# EAGLE schematic PX4uNode_V0_1_3 (EAGLE 6.5.0)

## Sheet 1 of 11
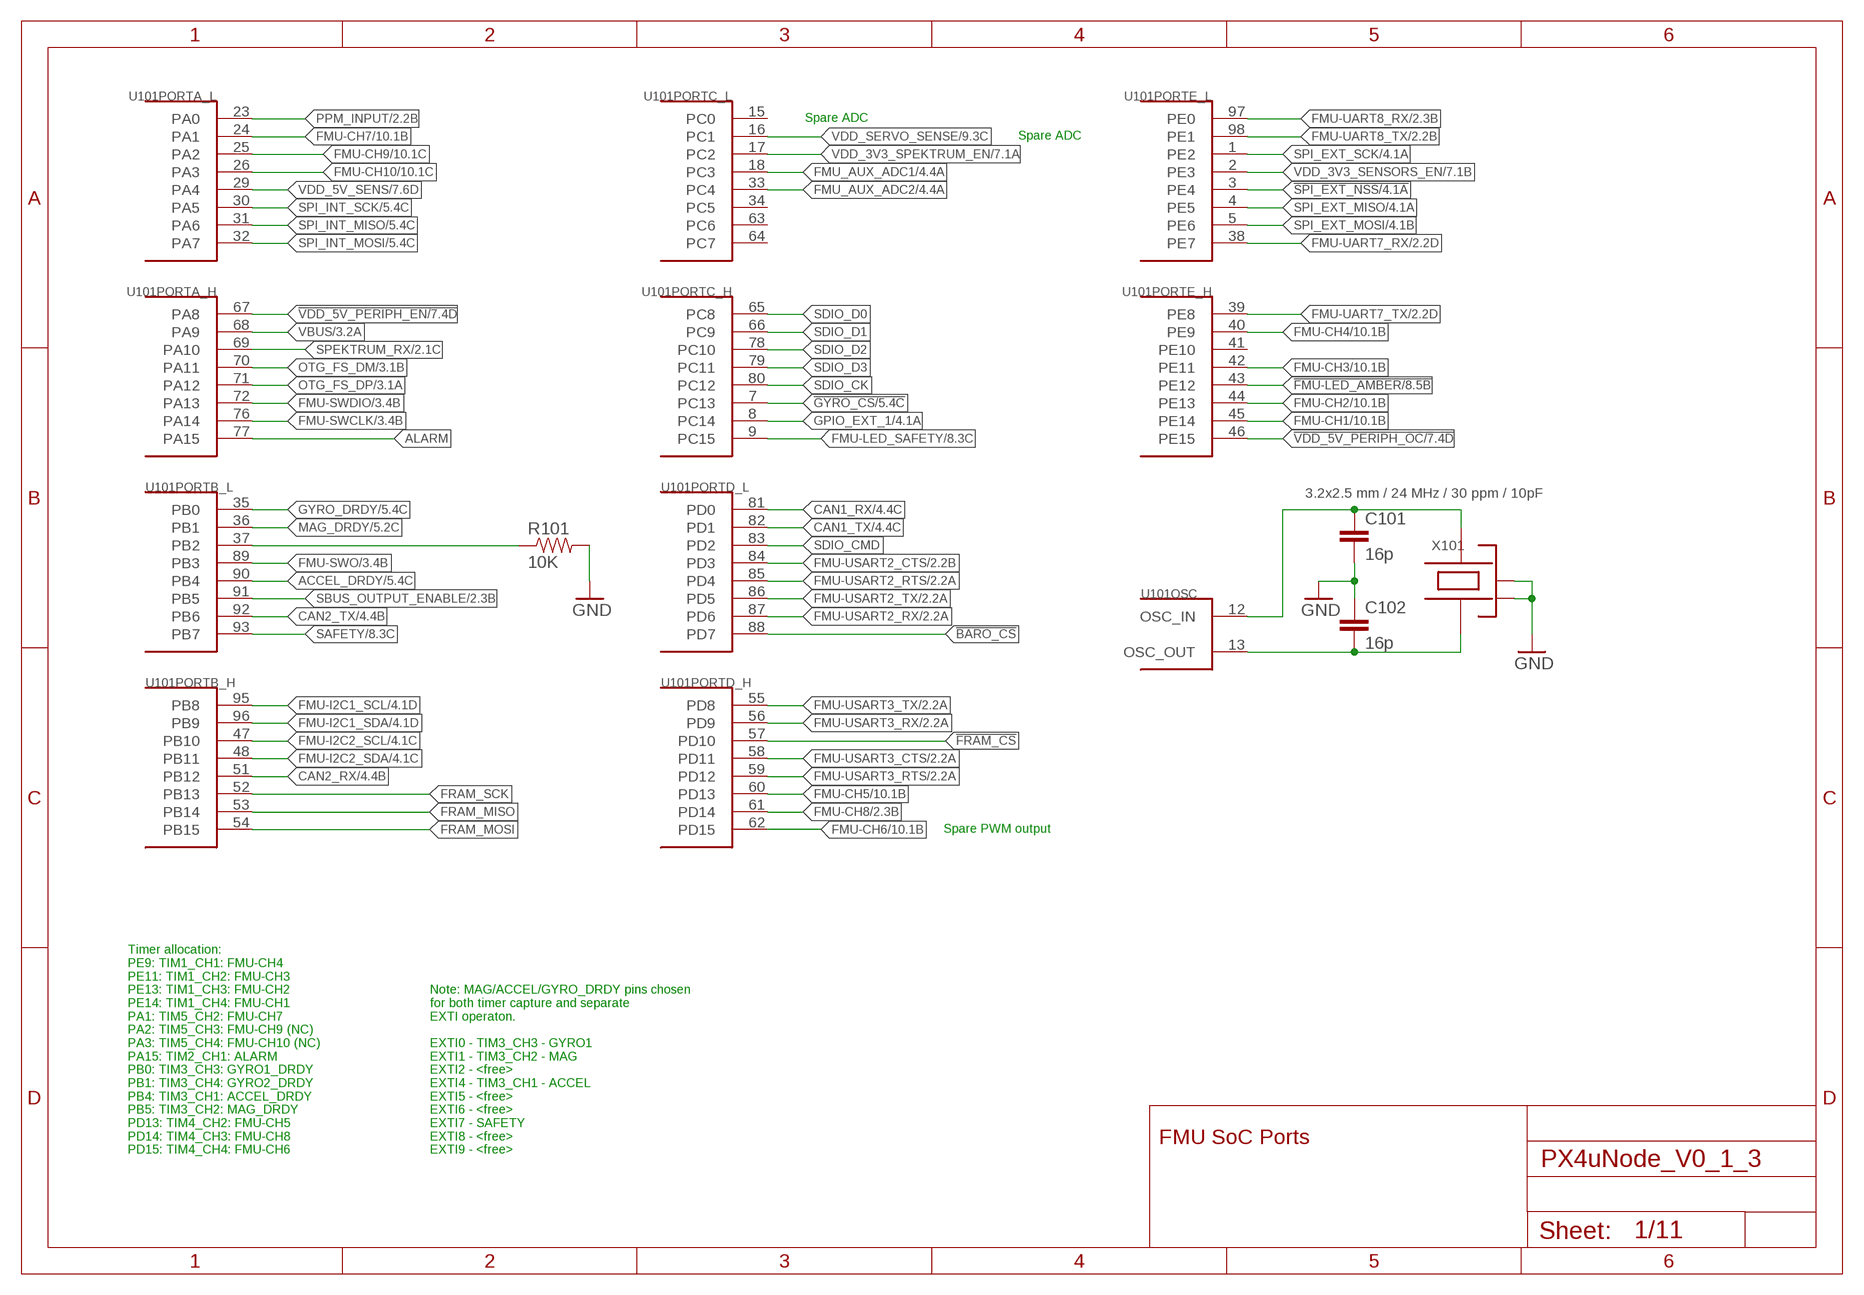
[diagram p0: schematic, sheet 1]

### Parts
C101  16p  CAP0402  [0402-CAP]
C102  16p  CAP0402  [0402-CAP]
R101  10K  RESISTOR0402-RES  [0402-RES]
U101  STM32F4X7VX  [TQFP100]
X101  3.2x2.5 mm / 24 MHz / 30 ppm / 10pF  OSCILLATOR-3.2X2.5  [OSCILLATOR-3.2X2.5]

### Nets
!BARO_CS: U101.88(PORTD_L:PD7)
!FMU-LED_AMBER: U101.43(PORTE_H:PE12) ; also sheet 8
!FRAM_CS: U101.57(PORTD_H:PD10)
!GYRO_CS: U101.7(PORTC_H:PC13) ; also sheet 5
!SPI_EXT_NSS: U101.3(PORTE_L:PE4) ; also sheet 4
!VDD_5V_PERIPH_EN: U101.67(PORTA_H:PA8) ; also sheet 7
!VDD_5V_PERIPH_OC: U101.46(PORTE_H:PE15) ; also sheet 7
ACCEL_DRDY: U101.90(PORTB_L:PB4) ; also sheet 5
ALARM: U101.77(PORTA_H:PA15)
CAN1_RX: U101.81(PORTD_L:PD0) ; also sheet 4
CAN1_TX: U101.82(PORTD_L:PD1) ; also sheet 4
CAN2_RX: U101.51(PORTB_H:PB12) ; also sheet 4
CAN2_TX: U101.92(PORTB_L:PB6) ; also sheet 4
CLK1: C101.P$1 U101.12(OSC:OSC_IN) X101.3
CLK2: C102.P$2 U101.13(OSC:OSC_OUT) X101.1
FMU-CH1: U101.45(PORTE_H:PE14) ; also sheet 10
FMU-CH2: U101.44(PORTE_H:PE13) ; also sheet 10
FMU-CH3: U101.42(PORTE_H:PE11) ; also sheet 10
FMU-CH4: U101.40(PORTE_H:PE9) ; also sheet 10
FMU-CH5: U101.60(PORTD_H:PD13) ; also sheet 10
FMU-CH6: U101.62(PORTD_H:PD15) ; also sheet 10
FMU-CH7: U101.24(PORTA_L:PA1) ; also sheet 10
FMU-CH8: U101.61(PORTD_H:PD14) ; also sheet 2,10
FMU-CH9: U101.25(PORTA_L:PA2) ; also sheet 10
FMU-CH10: U101.26(PORTA_L:PA3) ; also sheet 10
FMU-I2C1_SCL: U101.95(PORTB_H:PB8) ; also sheet 4
FMU-I2C1_SDA: U101.96(PORTB_H:PB9) ; also sheet 4
FMU-I2C2_SCL: U101.47(PORTB_H:PB10) ; also sheet 4
FMU-I2C2_SDA: U101.48(PORTB_H:PB11) ; also sheet 4
FMU-LED_SAFETY: U101.9(PORTC_H:PC15) ; also sheet 8
FMU-SWCLK: U101.76(PORTA_H:PA14) ; also sheet 3
FMU-SWDIO: U101.72(PORTA_H:PA13) ; also sheet 3
FMU-SWO: U101.89(PORTB_L:PB3) ; also sheet 3
FMU-UART7_RX: U101.38(PORTE_L:PE7) ; also sheet 2
FMU-UART7_TX: U101.39(PORTE_H:PE8) ; also sheet 2
FMU-UART8_RX: U101.97(PORTE_L:PE0) ; also sheet 2
FMU-UART8_TX: U101.98(PORTE_L:PE1) ; also sheet 2
FMU-USART2_CTS: U101.84(PORTD_L:PD3) ; also sheet 2
FMU-USART2_RTS: U101.85(PORTD_L:PD4) ; also sheet 2
FMU-USART2_RX: U101.87(PORTD_L:PD6) ; also sheet 2
FMU-USART2_TX: U101.86(PORTD_L:PD5) ; also sheet 2
FMU-USART3_CTS: U101.58(PORTD_H:PD11) ; also sheet 2
FMU-USART3_RTS: U101.59(PORTD_H:PD12) ; also sheet 2
FMU-USART3_RX: U101.56(PORTD_H:PD9) ; also sheet 2
FMU-USART3_TX: U101.55(PORTD_H:PD8) ; also sheet 2
FMU_AUX_ADC1: U101.18(PORTC_L:PC3) ; also sheet 4
FMU_AUX_ADC2: U101.33(PORTC_L:PC4) ; also sheet 4
FRAM_MISO: U101.53(PORTB_H:PB14)
FRAM_MOSI: U101.54(PORTB_H:PB15)
FRAM_SCK: U101.52(PORTB_H:PB13)
GND [power]: C101.P$2 C102.P$1 R101.P$2 X101.2(NC_2) X101.4(NC_4) ; also sheet 2,3,4,5,6,7,8,9,10
GPIO_EXT_1: U101.8(PORTC_H:PC14) ; also sheet 4
GYRO_DRDY: U101.35(PORTB_L:PB0) ; also sheet 5
MAG_DRDY: U101.36(PORTB_L:PB1) ; also sheet 5
OTG_FS_DM: U101.70(PORTA_H:PA11) ; also sheet 3
OTG_FS_DP: U101.71(PORTA_H:PA12) ; also sheet 3
PB2-BOOT1: R101.P$1 U101.37(PORTB_L:PB2)
PPM_INPUT: U101.23(PORTA_L:PA0) ; also sheet 2
SAFETY: U101.93(PORTB_L:PB7) ; also sheet 8
SBUS_OUTPUT_ENABLE: U101.91(PORTB_L:PB5) ; also sheet 2
SDIO_CK: U101.80(PORTC_H:PC12) ; also sheet 3
SDIO_CMD: U101.83(PORTD_L:PD2) ; also sheet 3
SDIO_D0: U101.65(PORTC_H:PC8) ; also sheet 3
SDIO_D1: U101.66(PORTC_H:PC9) ; also sheet 3
SDIO_D2: U101.78(PORTC_H:PC10) ; also sheet 3
SDIO_D3: U101.79(PORTC_H:PC11) ; also sheet 3
SPEKTRUM_RX: U101.69(PORTA_H:PA10) ; also sheet 2
SPI_EXT_MISO: U101.4(PORTE_L:PE5) ; also sheet 4
SPI_EXT_MOSI: U101.5(PORTE_L:PE6) ; also sheet 4
SPI_EXT_SCK: U101.1(PORTE_L:PE2) ; also sheet 4
SPI_INT_MISO: U101.31(PORTA_L:PA6) ; also sheet 5
SPI_INT_MOSI: U101.32(PORTA_L:PA7) ; also sheet 5
SPI_INT_SCK: U101.30(PORTA_L:PA5) ; also sheet 5
VBUS [power]: U101.68(PORTA_H:PA9) ; also sheet 3,9
VDD_3V3_SENSORS_EN: U101.2(PORTE_L:PE3) ; also sheet 7
VDD_3V3_SPEKTRUM_EN: U101.17(PORTC_L:PC2) ; also sheet 7
VDD_5V_SENS: U101.29(PORTA_L:PA4) ; also sheet 7
VDD_SERVO_SENSE: U101.16(PORTC_L:PC1) ; also sheet 9
Unconnected: U101.15(PORTC_L:PC0) U101.34(PORTC_L:PC5) U101.41(PORTE_H:PE10) U101.63(PORTC_L:PC6) U101.64(PORTC_L:PC7)

### Notes on the sheet
- Spare ADC
- Spare ADC
- Spare PWM output
- Timer allocation:
  PE9: TIM1_CH1: FMU-CH4
  PE11: TIM1_CH2: FMU-CH3
  PE13: TIM1_CH3: FMU-CH2
  PE14: TIM1_CH4: FMU-CH1
  PA1: TIM5_CH2: FMU-CH7
  PA2: TIM5_CH3: FMU-CH9 (NC)
  PA3: TIM5_CH4: FMU-CH10 (NC)
  PA15: TIM2_CH1: ALARM
  PB0: TIM3_CH3: GYRO1_DRDY
  PB1: TIM3_CH4: GYRO2_DRDY
  PB4: TIM3_CH1: ACCEL_DRDY
  PB5: TIM3_CH2: MAG_DRDY
  PD13: TIM4_CH2: FMU-CH5
  PD14: TIM4_CH3: FMU-CH8
  PD15: TIM4_CH4: FMU-CH6
- Note: MAG/ACCEL/GYRO_DRDY pins chosen
  for both timer capture and separate
  EXTI operaton.
  
  EXTI0 - TIM3_CH3 - GYRO1
  EXTI1 - TIM3_CH2 - MAG
  EXTI2 - <free>
  EXTI4 - TIM3_CH1 - ACCEL
  EXTI5 - <free>
  EXTI6 - <free>
  EXTI7 - SAFETY
  EXTI8 - <free>
  EXTI9 - <free>
- FMU SoC Ports

## Sheet 2 of 11
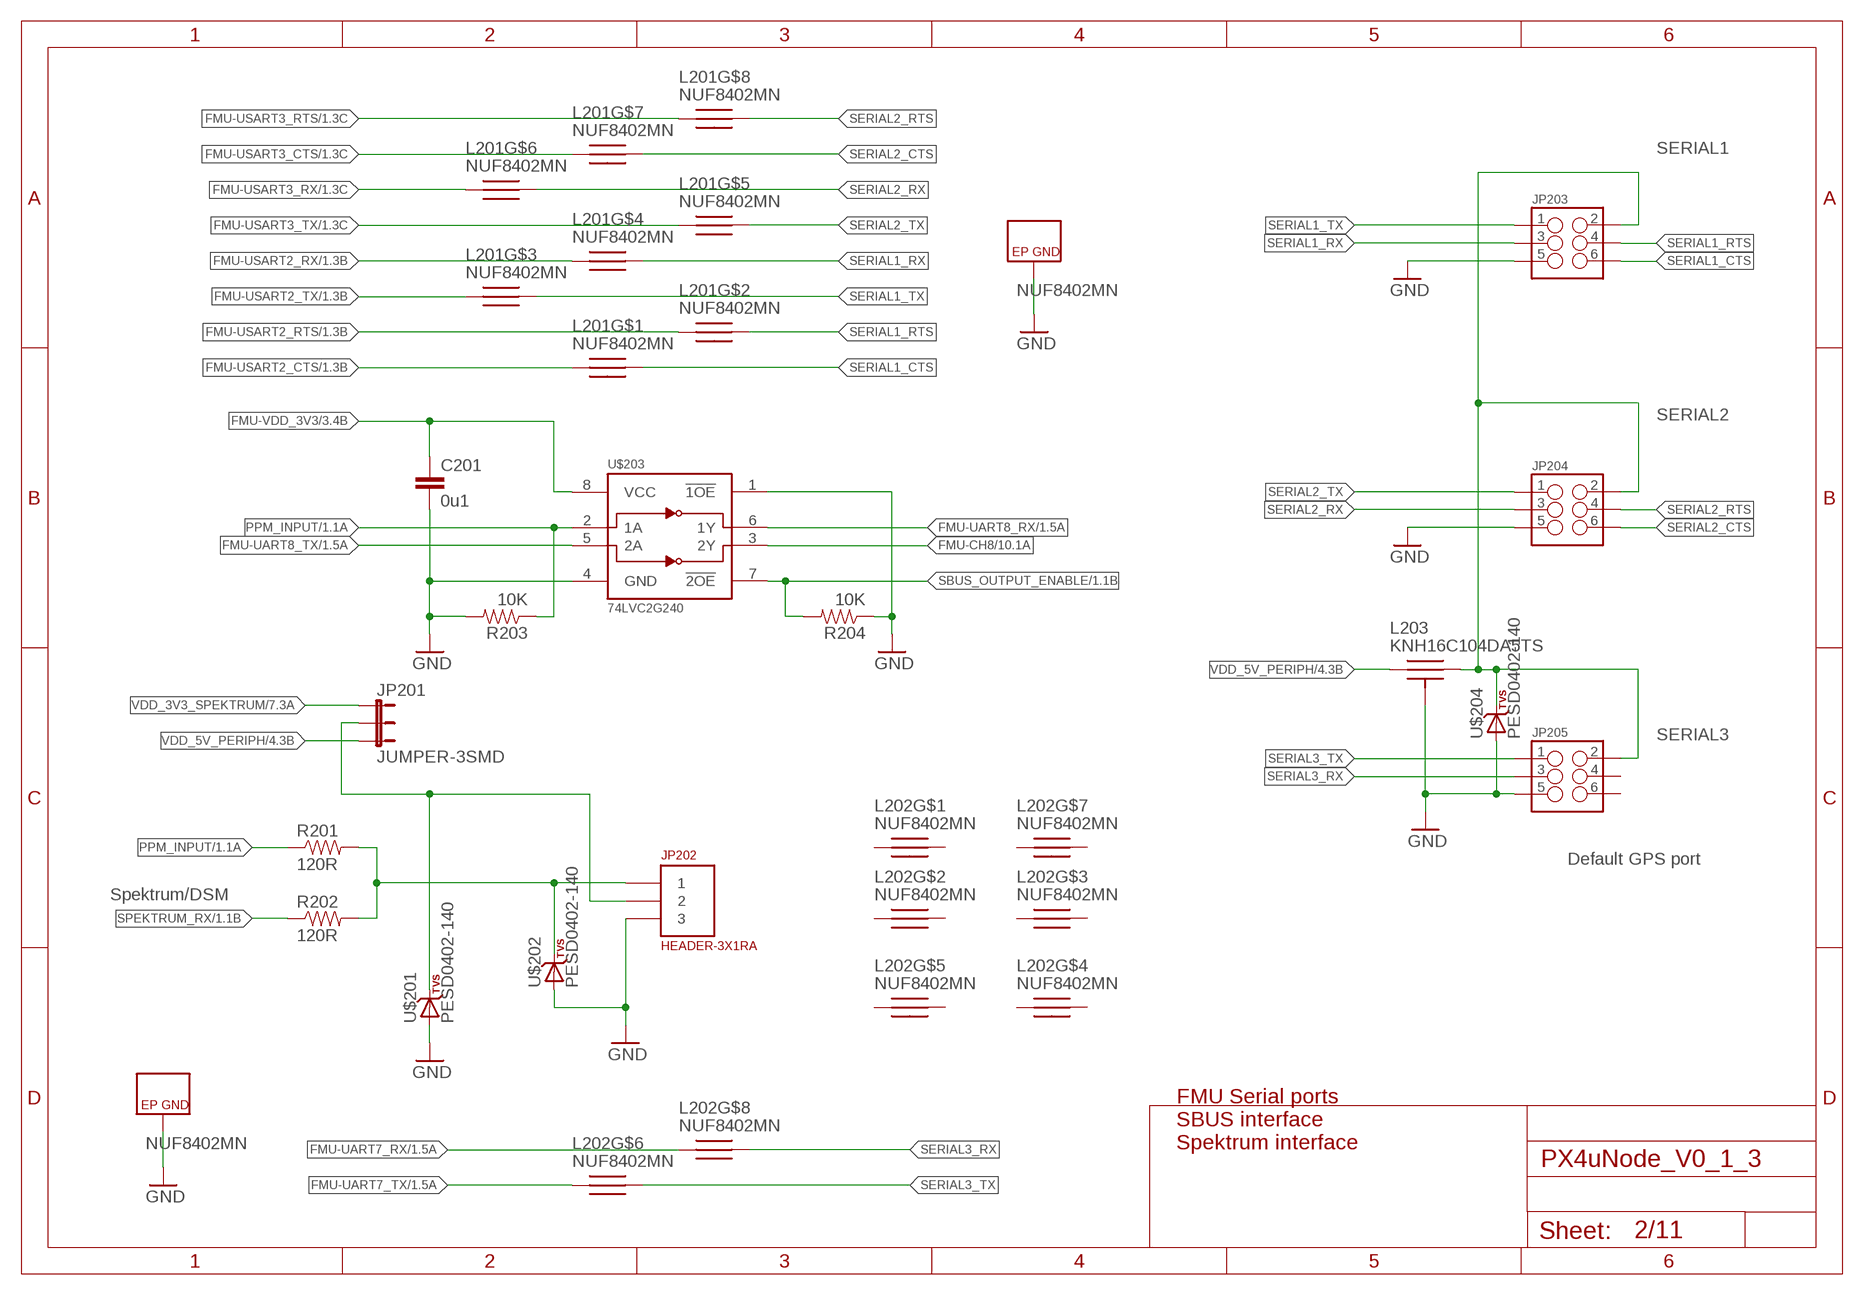
[diagram p1: schematic, sheet 2]

### Parts
C201  0u1  CAP0402  [0402-CAP]
JP201  JUMPER-3SMD  [SJ_3]
JP202  HEADER-3X1RA  [3X1RA]
JP203  M03X22X3_SILK_SM  [2X3]
JP204  M03X22X3_SILK_SM  [2X3]
JP205  M03X22X3_SILK_SM  [2X3]
L201  NUF8402MN  [DFN16-THIN]
L202  NUF8402MN  [DFN16-THIN]
L203  KNH16C104DA5TS  [KYOCERA-KNH16-DA]
R201  120R  RESISTOR0402-RES  [0402-RES]
R202  120R  RESISTOR0402-RES  [0402-RES]
R203  10K  RESISTOR0402-RES  [0402-RES]
R204  10K  RESISTOR0402-RES  [0402-RES]
U$201  PESD0402-140  DIODE-TVS  [0402-TVS]
U$202  PESD0402-140  DIODE-TVS  [0402-TVS]
U$203  74LVC2G240  [VSSOP8]
U$204  PESD0402-140  DIODE-TVS  [0402-TVS]

### Nets
5V_S3_FILTERED [power]: JP203.2 JP204.2 JP205.2 L203.P$2 U$204.C
FMU-CH8: U$203.3(2Y) ; also sheet 1,10
FMU-UART7_RX: L202.P$8 ; also sheet 1
FMU-UART7_TX: L202.P$6 ; also sheet 1
FMU-UART8_RX: U$203.6(1Y) ; also sheet 1
FMU-UART8_TX: U$203.5(2A) ; also sheet 1
FMU-USART2_CTS: L201.P$1 ; also sheet 1
FMU-USART2_RTS: L201.P$2 ; also sheet 1
FMU-USART2_RX: L201.P$4 ; also sheet 1
FMU-USART2_TX: L201.P$3 ; also sheet 1
FMU-USART3_CTS: L201.P$7 ; also sheet 1
FMU-USART3_RTS: L201.P$8 ; also sheet 1
FMU-USART3_RX: L201.P$6 ; also sheet 1
FMU-USART3_TX: L201.P$5 ; also sheet 1
FMU-VDD_3V3 [power]: C201.P$1 U$203.8(VCC) ; also sheet 3,4,7,8
GND [power]: C201.P$2 JP202.3 JP203.5 JP204.5 JP205.5 L201.P$EP(GND) L202.P$EP(GND) L203.P$3 L203.P$4 L203.P$5 R203.P$2 R204.P$1 U$201.A U$202.A U$203.1(!1OE) U$203.4(GND) U$204.A ; also sheet 1,3,4,5,6,7,8,9,10
N$2: JP202.1 R201.P$2 R202.P$2 U$202.C
N$18: JP201.2 JP202.2 U$201.C
PPM_INPUT: R201.P$1 R203.P$1 U$203.2(1A) ; also sheet 1
SBUS_OUTPUT_ENABLE: R204.P$2 U$203.7(!2OE) ; also sheet 1
SERIAL1_CTS: JP203.6 L201.P$16
SERIAL1_RTS: JP203.4 L201.P$15
SERIAL1_RX: JP203.3 L201.P$13
SERIAL1_TX: JP203.1 L201.P$14
SERIAL2_CTS: JP204.6 L201.P$10
SERIAL2_RTS: JP204.4 L201.P$9
SERIAL2_RX: JP204.3 L201.P$11
SERIAL2_TX: JP204.1 L201.P$12
SERIAL3_RX: JP205.3 L202.P$9
SERIAL3_TX: JP205.1 L202.P$11
SPEKTRUM_RX: R202.P$1 ; also sheet 1
VDD_3V3_SPEKTRUM [power]: JP201.1 ; also sheet 7
VDD_5V_PERIPH [power]: JP201.3 L203.P$1 ; also sheet 4,7
Unconnected: JP205.4 JP205.6 L202.P$1 L202.P$2 L202.P$3 L202.P$4 L202.P$5 L202.P$7 L202.P$10 L202.P$12 L202.P$13 L202.P$14 L202.P$15 L202.P$16

### Notes on the sheet
- SERIAL1
- SERIAL2
- SERIAL3
- Default GPS port
- Spektrum/DSM
- FMU Serial ports
  SBUS interface
  Spektrum interface

## Sheet 3 of 11
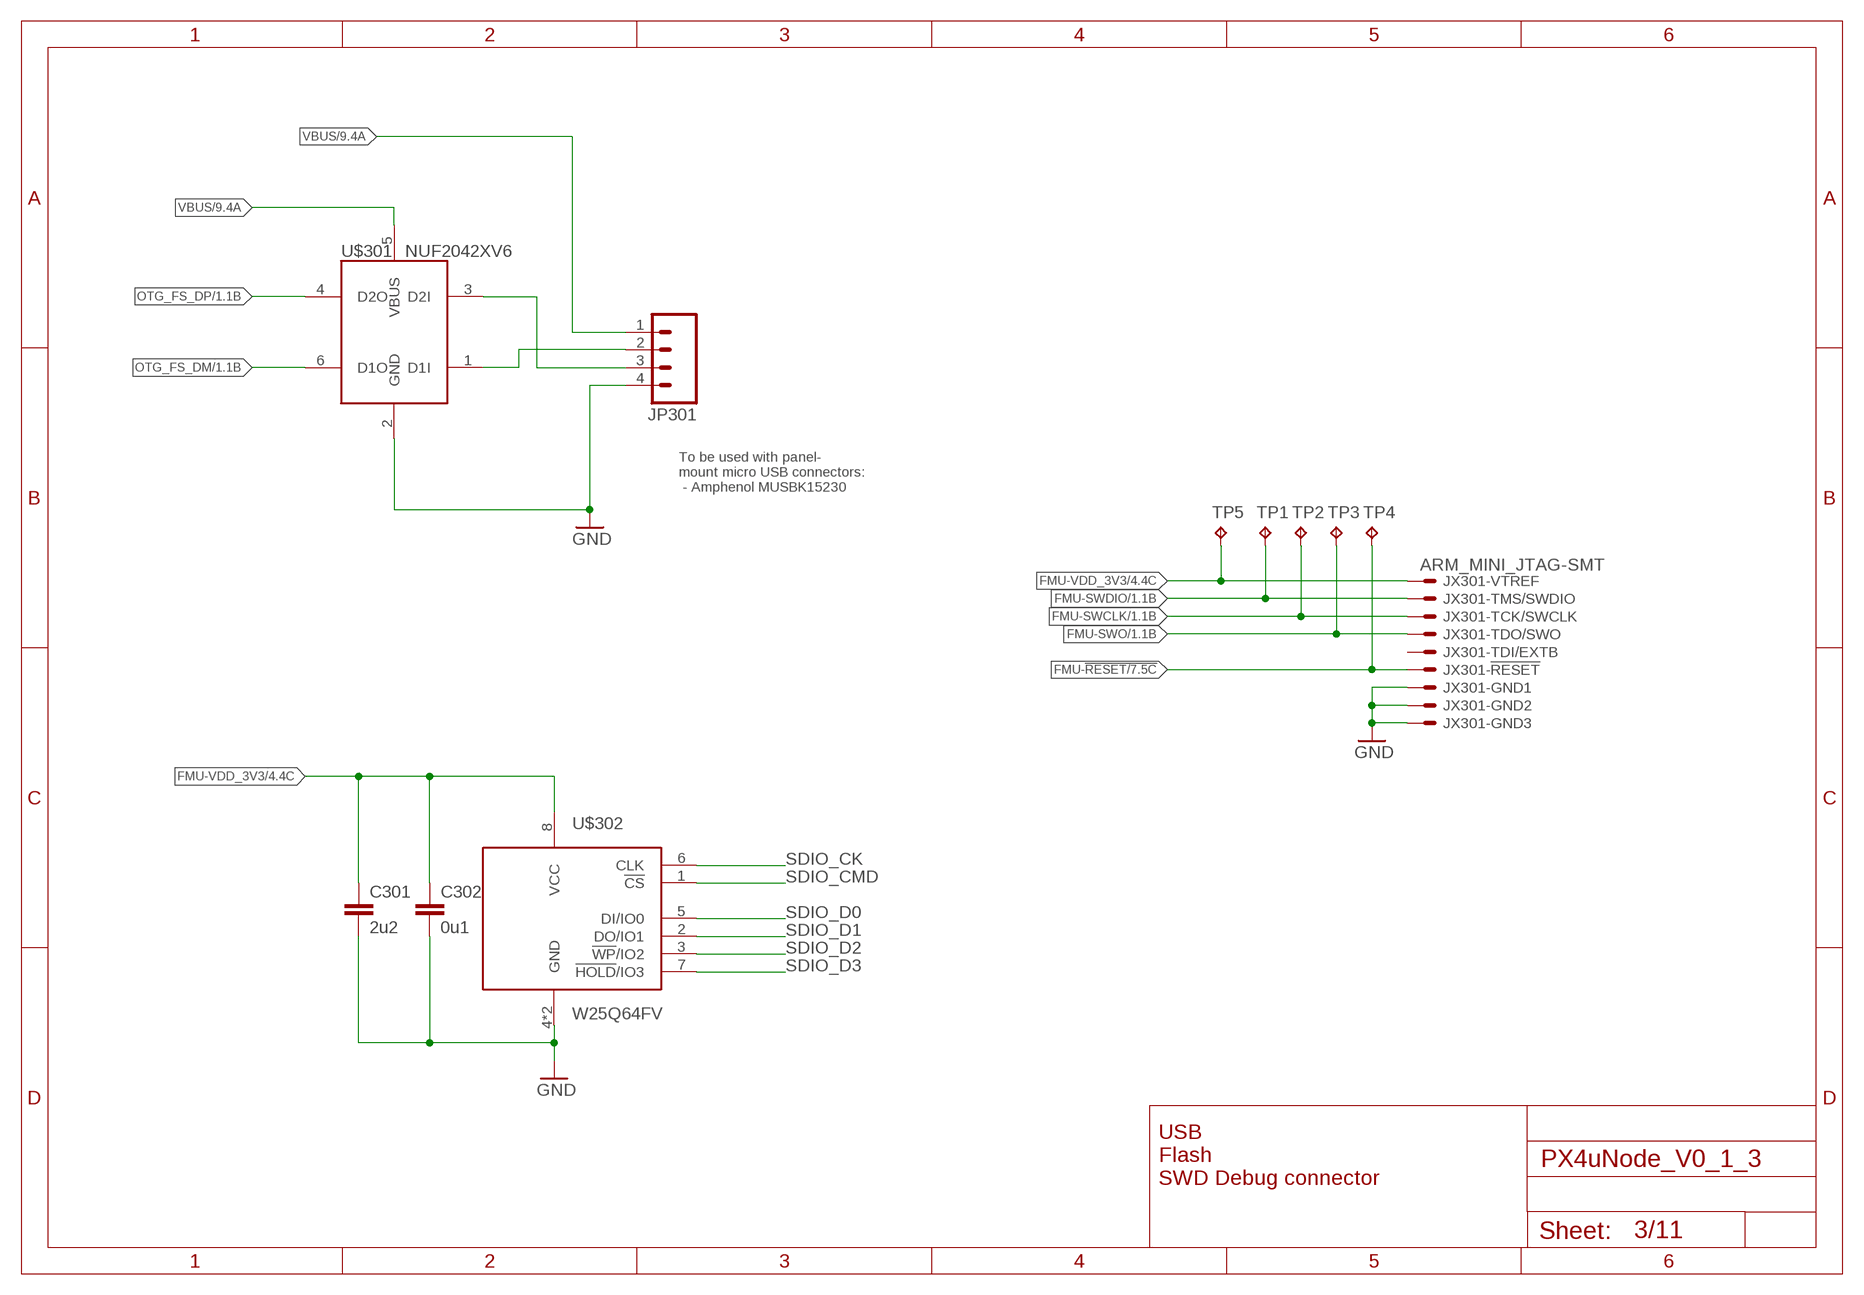
[diagram p2: schematic, sheet 3]

### Parts
C301  2u2  CAP0603  [0603-CAP]
C302  0u1  CAP0402  [0402-CAP]
JP301  M04PTH  [1X04]
JX301  ARM_MINI_JTAG-SMT  [FTSH-105-01-XXX-DV-K]
TP1  TPTP20R  [TP20R]
TP2  TPTP20R  [TP20R]
TP3  TPTP20R  [TP20R]
TP4  TPTP20R  [TP20R]
TP5  TPTP20R  [TP20R]
U$301  NUF2042XV6  [SOT563-6]
U$302  W25Q64FV  [WSON-8-5X6]

### Nets
FMU-!RESET: JX301.10 TP4.TP ; also sheet 7
FMU-SWCLK: JX301.4 TP2.TP ; also sheet 1
FMU-SWDIO: JX301.2 TP1.TP ; also sheet 1
FMU-SWO: JX301.6 TP3.TP ; also sheet 1
FMU-VDD_3V3 [power]: C301.P$1 C302.P$1 JX301.1 TP5.TP U$302.8(VCC) ; also sheet 2,4,7,8
GND [power]: C301.P$2 C302.P$2 JP301.4 JX301.3 JX301.5 JX301.9 U$301.2(GND) U$302.4(GND) U$302.PAD(GND) ; also sheet 1,2,4,5,6,7,8,9,10
OTG_FS_DM: U$301.6(D1O) ; also sheet 1
OTG_FS_DP: U$301.4(D2O) ; also sheet 1
SDIO_CK: U$302.6(CLK) ; also sheet 1
SDIO_CMD: U$302.1(!CS) ; also sheet 1
SDIO_D0: U$302.5(DI/IO0) ; also sheet 1
SDIO_D1: U$302.2(DO/IO1) ; also sheet 1
SDIO_D2: U$302.3(!WP!/IO2) ; also sheet 1
SDIO_D3: U$302.7(!HOLD!/IO3) ; also sheet 1
UDB_DP: JP301.3 U$301.3(D2I)
USB_DM: JP301.2 U$301.1(D1I)
VBUS [power]: JP301.1 U$301.5(VBUS) ; also sheet 1,9
Unconnected: JX301.8

### Notes on the sheet
- To be used with panel-
  mount micro USB connectors:
   - Amphenol MUSBK15230
- USB
  Flash
  SWD Debug connector

## Sheet 4 of 11
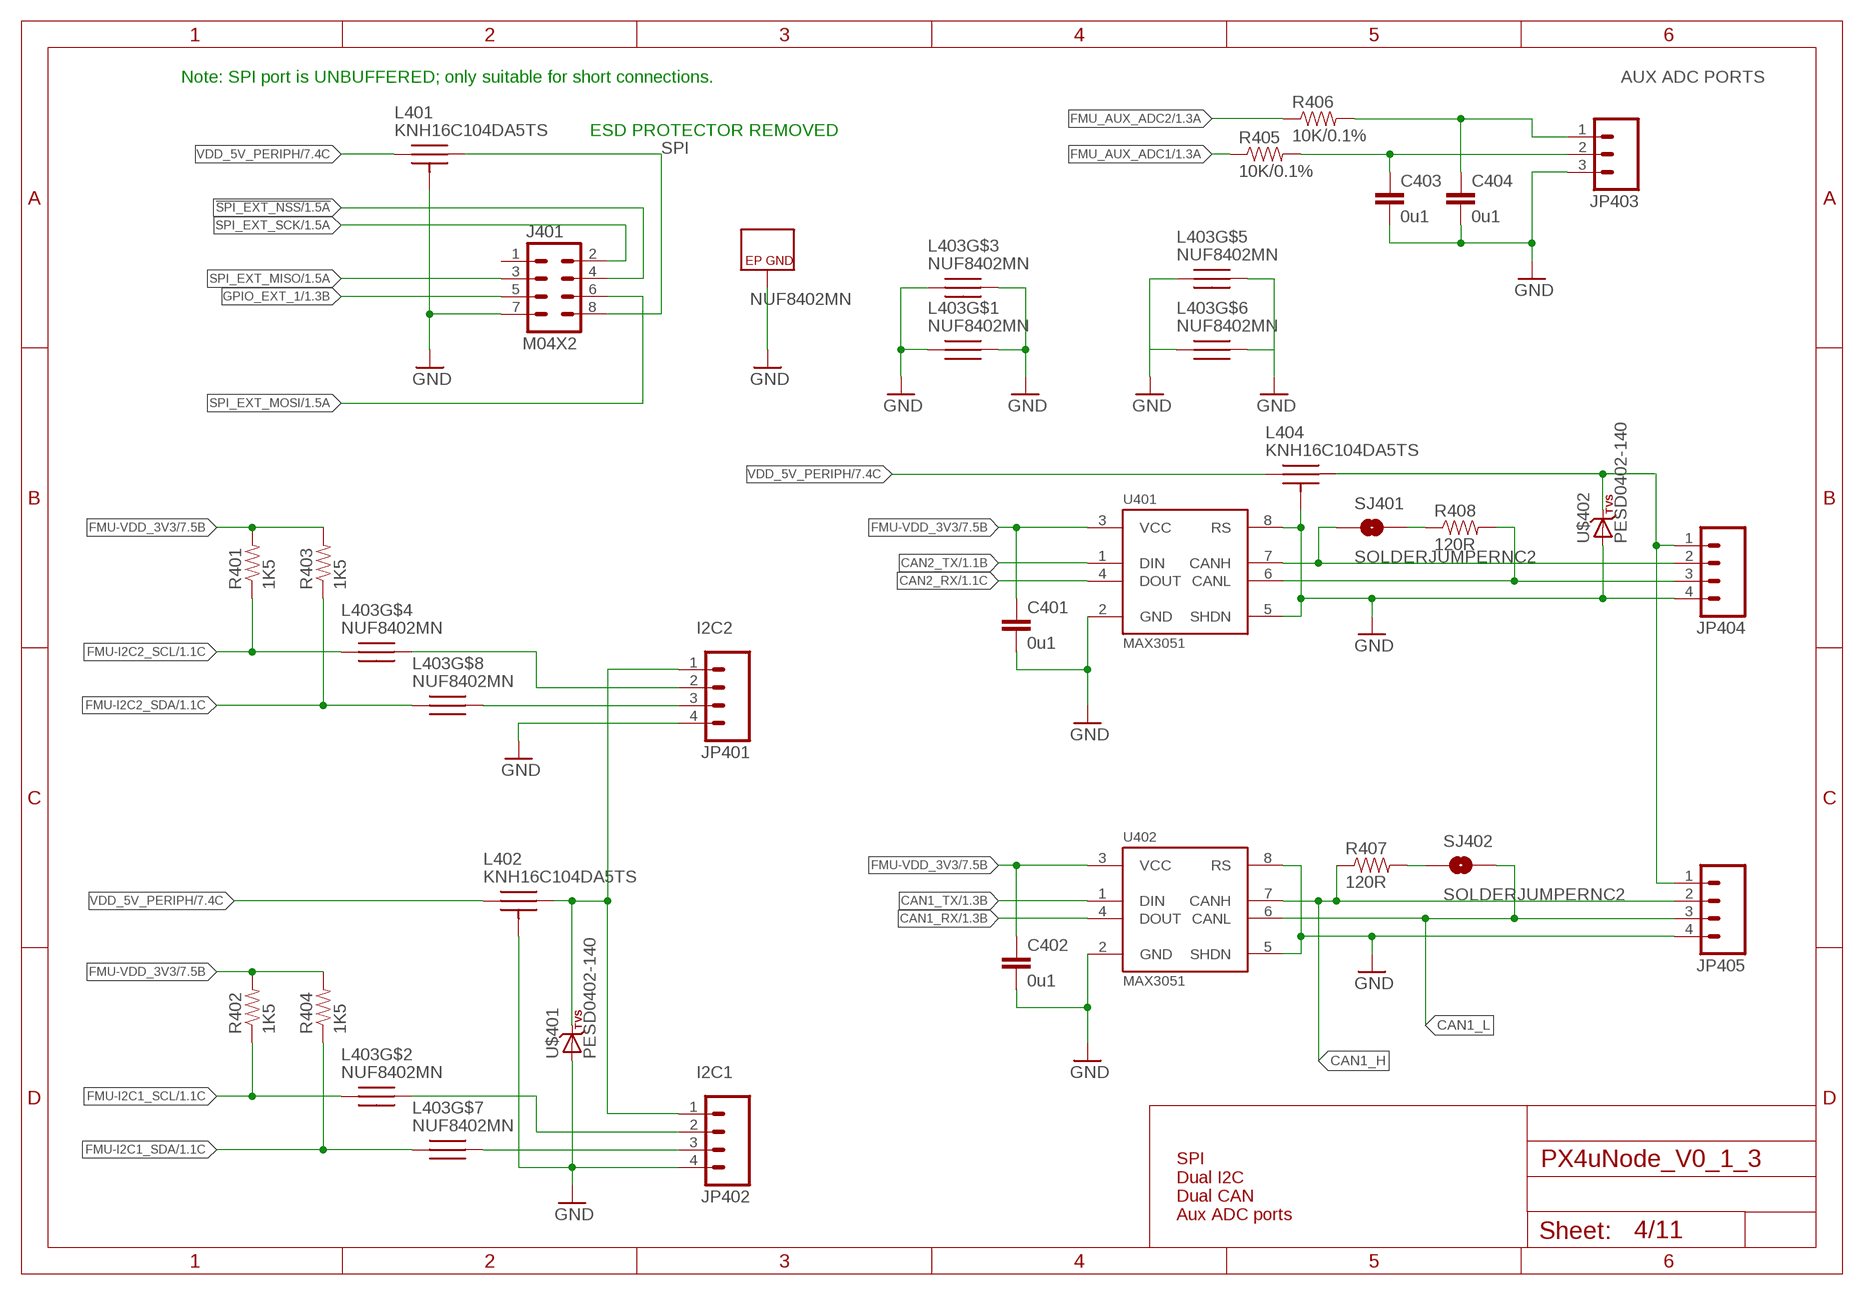
[diagram p3: schematic, sheet 4]

### Parts
C401  0u1  CAP0402  [0402-CAP]
C402  0u1  CAP0402  [0402-CAP]
C403  0u1  CAP0402  [0402-CAP]
C404  0u1  CAP0402  [0402-CAP]
J401  M04X2  [2X4]
JP401  M04PTH  [1X04]
JP402  M04PTH  [1X04]
JP403  M03PTH  [1X03]
JP404  M04PTH  [1X04]
JP405  M04PTH  [1X04]
L401  KNH16C104DA5TS  [KYOCERA-KNH16-DA]
L402  KNH16C104DA5TS  [KYOCERA-KNH16-DA]
L403  NUF8402MN  [DFN16-THIN]
L404  KNH16C104DA5TS  [KYOCERA-KNH16-DA]
R401  1K5  RESISTOR0402-RES  [0402-RES]
R402  1K5  RESISTOR0402-RES  [0402-RES]
R403  1K5  RESISTOR0402-RES  [0402-RES]
R404  1K5  RESISTOR0402-RES  [0402-RES]
R405  10K/0.1%  RESISTOR0402-RES  [0402-RES]
R406  10K/0.1%  RESISTOR0402-RES  [0402-RES]
R407  120R  RESISTOR0402-RES  [0402-RES]
R408  120R  RESISTOR0402-RES  [0402-RES]
SJ401  SOLDERJUMPERNC2  [SJ_2S-NOTRACE]
SJ402  SOLDERJUMPERNC2  [SJ_2S-NOTRACE]
U401  MAX3051  MAX3051MAX3051EKA  [SOT23-8]
U402  MAX3051  MAX3051MAX3051EKA  [SOT23-8]
U$401  PESD0402-140  DIODE-TVS  [0402-TVS]
U$402  PESD0402-140  DIODE-TVS  [0402-TVS]

### Nets
!SPI_EXT_NSS: J401.4 ; also sheet 1
CAN1_H: JP405.2 R407.P$1 U402.7(CANH)
CAN1_L: JP405.3 SJ402.2 U402.6(CANL)
CAN1_RX: U402.4(DOUT) ; also sheet 1
CAN1_TX: U402.1(DIN) ; also sheet 1
CAN2_H: JP404.2 SJ401.1 U401.7(CANH)
CAN2_L: JP404.3 R408.P$2 U401.6(CANL)
CAN2_RX: U401.4(DOUT) ; also sheet 1
CAN2_TX: U401.1(DIN) ; also sheet 1
FMU-I2C1_SCL: L403.P$2 R402.P$1 ; also sheet 1
FMU-I2C1_SDA: L403.P$7 R404.P$1 ; also sheet 1
FMU-I2C2_SCL: L403.P$4 R401.P$1 ; also sheet 1
FMU-I2C2_SDA: L403.P$8 R403.P$1 ; also sheet 1
FMU-VDD_3V3 [power]: C401.P$1 C402.P$1 R401.P$2 R402.P$2 R403.P$2 R404.P$2 U401.3(VCC) U402.3(VCC) ; also sheet 2,3,7,8
FMU_AUX_ADC1: R405.P$1 ; also sheet 1
FMU_AUX_ADC1_PROT: C403.P$1 JP403.2 R405.P$2
FMU_AUX_ADC2: R406.P$1 ; also sheet 1
FMU_AUX_ADC2_PROT: C404.P$1 JP403.1 R406.P$2
GND [power]: C401.P$2 C402.P$2 C403.P$2 C404.P$2 J401.7 JP401.4 JP402.4 JP403.3 JP404.4 JP405.4 L401.P$3 L401.P$4 L401.P$5 L402.P$3 L402.P$4 L402.P$5 L403.P$1 L403.P$3 L403.P$5 L403.P$6 L403.P$11 L403.P$12 L403.P$14 L403.P$16 L403.P$EP(GND) L404.P$3 L404.P$4 L404.P$5 U401.2(GND) U401.5(SHDN) U401.8(RS) U402.2(GND) U402.5(SHDN) U402.8(RS) U$401.A U$402.A ; also sheet 1,2,3,5,6,7,8,9,10
GPIO_EXT_1: J401.5 ; also sheet 1
IC2_VDD_5V [power]: JP401.1 JP402.1 L402.P$2 U$401.C
N$4: JP401.2 L403.P$13
N$20: JP401.3 L403.P$9
N$21: R408.P$1 SJ401.2
N$22: R407.P$2 SJ402.1
N$28 [power]: JP404.1 JP405.1 L404.P$2 U$402.C
N$33: JP402.2 L403.P$15
N$37: JP402.3 L403.P$10
N$41 [power]: J401.8 L401.P$2
SPI_EXT_MISO: J401.3 ; also sheet 1
SPI_EXT_MOSI: J401.6 ; also sheet 1
SPI_EXT_SCK: J401.2 ; also sheet 1
VDD_5V_PERIPH [power]: L401.P$1 L402.P$1 L404.P$1 ; also sheet 2,7
Unconnected: J401.1

### Notes on the sheet
- Note: SPI port is UNBUFFERED; only suitable for short connections. | AUX ADC PORTS
- ESD PROTECTOR REMOVED
- SPI
- I2C2
- I2C1
- SPI
  Dual I2C
  Dual CAN
  Aux ADC ports

## Sheet 5 of 11
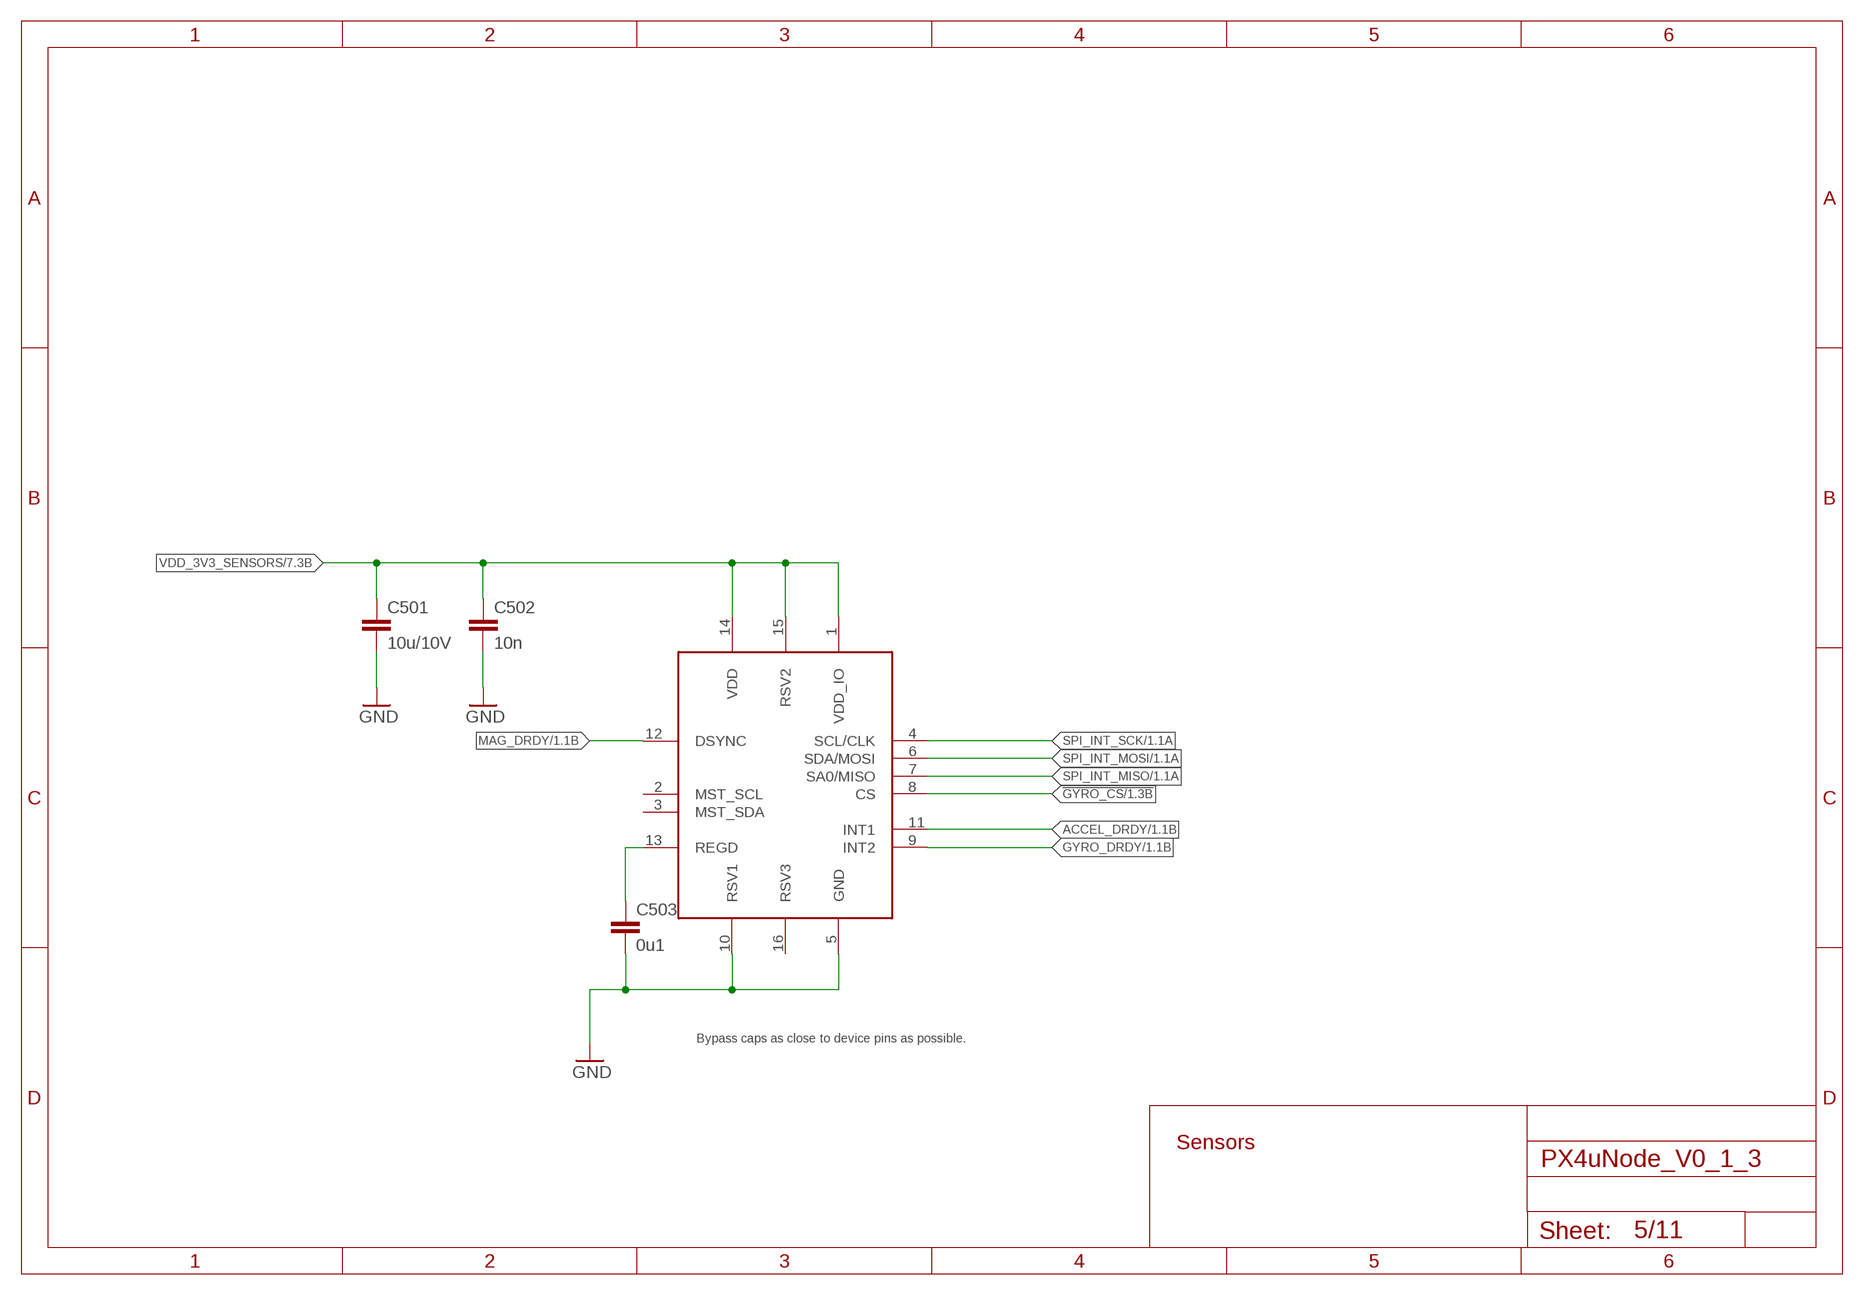
[diagram p4: schematic, sheet 5]

### Parts
C501  10u/10V  CAP0805  [0805-CAP]
C502  10n  CAP0402  [0402-CAP]
C503  0u1  CAP0402  [0402-CAP]
U$501  MAX21100  [16LGA-3X3]

### Nets
!GYRO_CS: U$501.8(CS) ; also sheet 1
ACCEL_DRDY: U$501.11(INT1) ; also sheet 1
GND [power]: C501.P$2 C502.P$2 C503.P$2 U$501.5(GND) U$501.10(RSV1) ; also sheet 1,2,3,4,6,7,8,9,10
GYRO_DRDY: U$501.9(INT2) ; also sheet 1
MAG_DRDY: U$501.12(DSYNC) ; also sheet 1
REGD: C503.P$1 U$501.13(REGD)
SPI_INT_MISO: U$501.7(SA0/MISO) ; also sheet 1
SPI_INT_MOSI: U$501.6(SDA/MOSI) ; also sheet 1
SPI_INT_SCK: U$501.4(SCL/CLK) ; also sheet 1
VDD_3V3_SENSORS [power]: C501.P$1 C502.P$1 U$501.1(VDD_IO) U$501.14(VDD) U$501.15(RSV2) ; also sheet 7
Unconnected: U$501.2(MST_SCL) U$501.3(MST_SDA) U$501.16(RSV3)

### Notes on the sheet
- Bypass caps as close to device pins as possible.
- Sensors

## Sheet 6 of 11
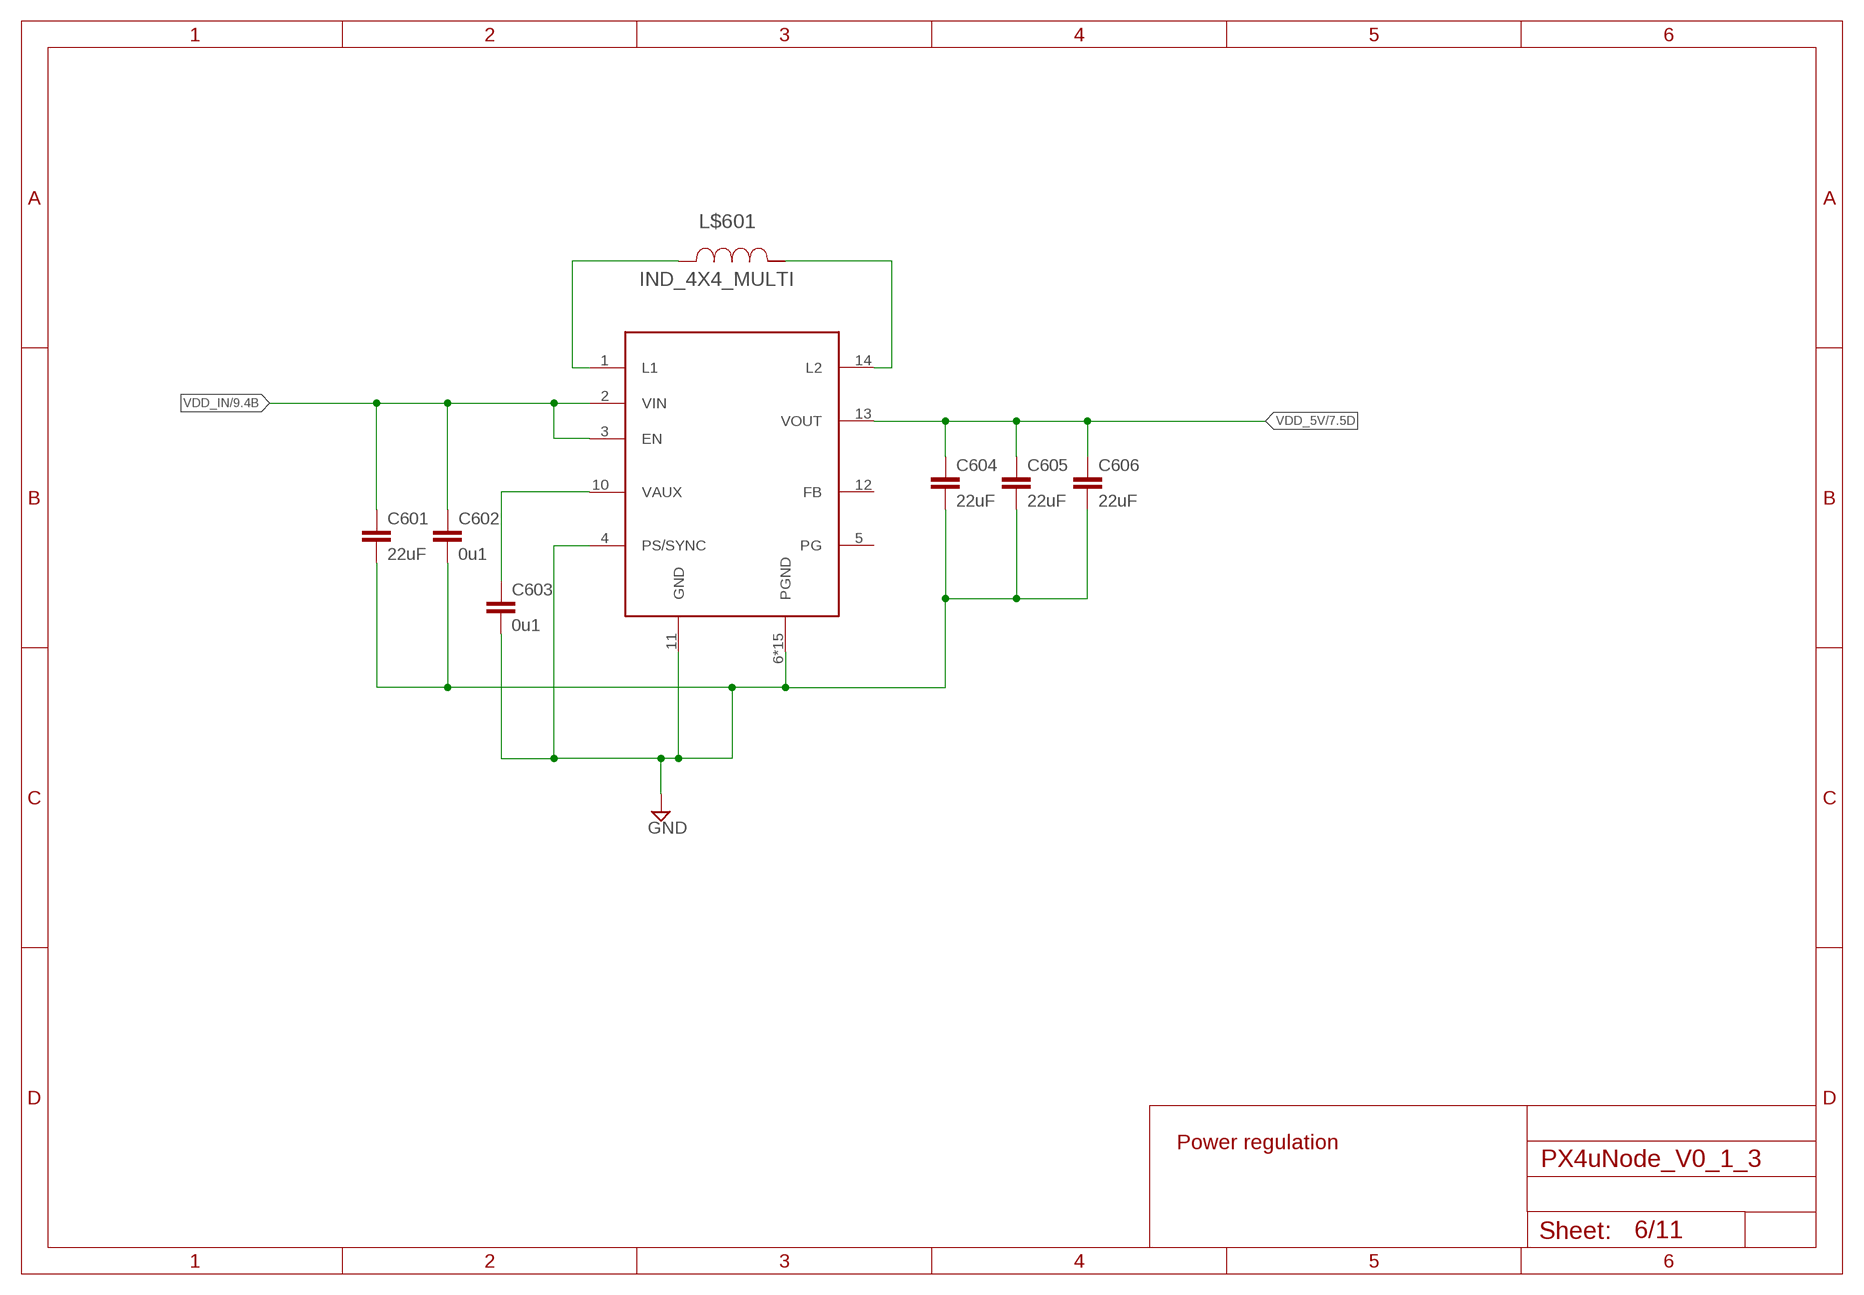
[diagram p5: schematic, sheet 6]

### Parts
C601  22uF  22UF-16V-20%-(1210)  [1210]
C602  0u1  CAP0402  [0402-CAP]
C603  0u1  CAP0402  [0402-CAP]
C604  22uF  22UF-16V-20%-(1210)  [1210]
C605  22uF  22UF-16V-20%-(1210)  [1210]
C606  22uF  22UF-16V-20%-(1210)  [1210]
L$601  IND_4X4_MULTI  [IND_4X4_MULTI]
U$601  TPS6303X  [PWSON10]

### Nets
GND [power]: C601.2 C602.P$2 C603.P$2 C604.2 C605.2 C606.2 U$601.4(PS/SYNC) U$601.6(PGND) U$601.7(PGND) U$601.8(PGND) U$601.9(PGND) U$601.11(GND) U$601.15(PGND) U$601.16(PGND) U$601.17(PGND) U$601.18(PGND) U$601.19(PGND) U$601.20(PGND) U$601.21(PGND) U$601.22(PGND) U$601.23(PGND) U$601.EP1(PGND) U$601.EP(PGND) ; also sheet 1,2,3,4,5,7,8,9,10
N$10: L$601.1 U$601.14(L2)
N$17: L$601.2 U$601.1(L1)
N$27: C603.P$1 U$601.10(VAUX)
VDD_5V [power]: C604.1 C605.1 C606.1 U$601.13(VOUT) ; also sheet 7,8
VDD_IN [power]: C601.1 C602.P$1 U$601.2(VIN) U$601.3(EN) ; also sheet 9
Unconnected: U$601.5(PG) U$601.12(FB)

### Notes on the sheet
- Power regulation

## Sheet 7 of 11
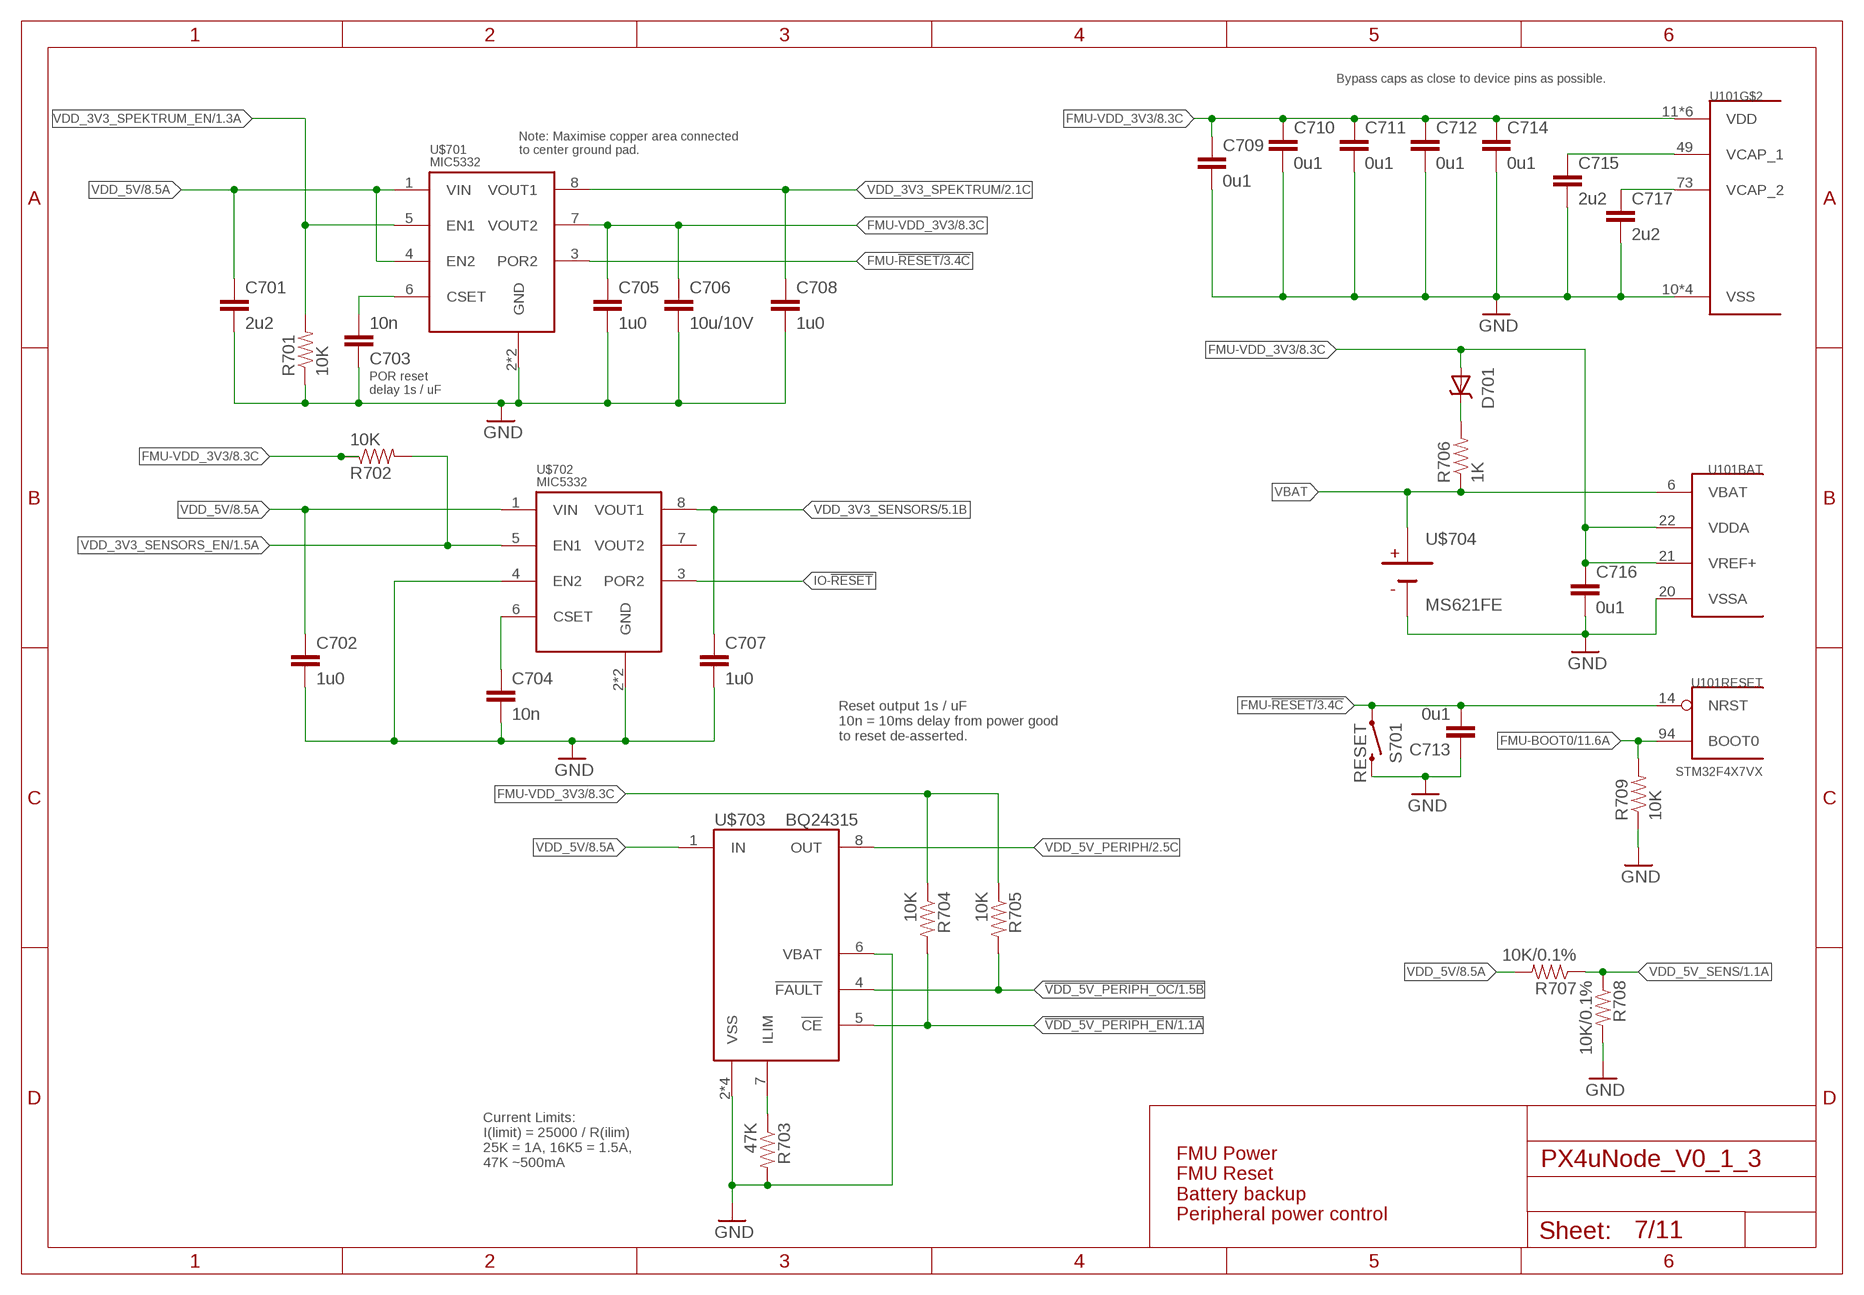
[diagram p6: schematic, sheet 7]

### Parts
C701  2u2  CAP0603  [0603-CAP]
C702  1u0  CAP0603  [0603-CAP]
C703  10n  CAP0402  [0402-CAP]
C704  10n  CAP0402  [0402-CAP]
C705  1u0  CAP0603  [0603-CAP]
C706  10u/10V  CAP0805  [0805-CAP]
C707  1u0  CAP0603  [0603-CAP]
C708  1u0  CAP0603  [0603-CAP]
C709  0u1  CAP0402  [0402-CAP]
C710  0u1  CAP0402  [0402-CAP]
C711  0u1  CAP0402  [0402-CAP]
C712  0u1  CAP0402  [0402-CAP]
C713  0u1  CAP0402  [0402-CAP]
C714  0u1  CAP0402  [0402-CAP]
C715  2u2  CAP0603  [0603-CAP]
C716  0u1  CAP0402  [0402-CAP]
C717  2u2  CAP0603  [0603-CAP]
D701  DIODE-SCHOTTKY  [SOD-523]
R701  10K  RESISTOR0402-RES  [0402-RES]
R702  10K  RESISTOR0402-RES  [0402-RES]
R703  47K  RESISTOR0402-RES  [0402-RES]
R704  10K  RESISTOR0402-RES  [0402-RES]
R705  10K  RESISTOR0402-RES  [0402-RES]
R706  1K  RESISTOR0402-RES  [0402-RES]
R707  10K/0.1%  RESISTOR0402-RES  [0402-RES]
R708  10K/0.1%  RESISTOR0402-RES  [0402-RES]
R709  10K  RESISTOR0402-RES  [0402-RES]
S701  RESET  SWITCH-MOMENTARY-2  [EVQP7J01K]
U$701  MIC5332  [MLF-8-EPAD]
U$702  MIC5332  [MLF-8-EPAD]
U$703  BQ24315  [QFN8-DSG]
U$704  MS621FE  [MS621FE]

### Nets
!VDD_5V_PERIPH_EN: R704.P$2 U$703.5(!CE) ; also sheet 1
!VDD_5V_PERIPH_OC: R705.P$2 U$703.4(!FAULT) ; also sheet 1
FMU-!RESET: C713.P$2 S701.A1 U101.14(RESET:NRST) U$701.3(POR2) ; also sheet 3
FMU-BOOT0: R709.P$2 U101.94(RESET:BOOT0) ; also sheet 11
FMU-VDD_3V3 [power]: C705.P$1 C706.P$1 C709.P$1 C710.P$1 C711.P$1 C712.P$1 C714.P$1 C716.P$1 D701.A R702.P$1 R704.P$1 R705.P$1 U101.11(VDD) U101.19(VDD) U101.21(BAT:VREF+) U101.22(BAT:VDDA) U101.28(VDD) U101.50(VDD) U101.75(VDD) U101.100(VDD) U$701.7(VOUT2) ; also sheet 2,3,4,8
GND [power]: C701.P$2 C702.P$2 C703.P$1 C704.P$2 C705.P$2 C706.P$2 C707.P$2 C708.P$2 C709.P$2 C710.P$2 C711.P$2 C712.P$2 C713.P$1 C714.P$2 C715.P$2 C716.P$2 C717.P$2 R701.P$1 R703.P$2 R708.P$2 R709.P$1 S701.B3 U101.10(VSS) U101.20(BAT:VSSA) U101.27(VSS) U101.74(VSS) U101.99(VSS) U$701.2(GND) U$701.GND U$702.2(GND) U$702.4(EN2) U$702.GND U$703.2(VSS) U$703.6(VBAT) U$703.GND(VSS) U$703.P$2(VSS) U$703.P$3(VSS) U$704.2(NEG) ; also sheet 1,2,3,4,5,6,8,9,10
IO-!RESET: U$702.3(POR2)
N$9: D701.C R706.P$2
N$11: C703.P$2 U$701.6(CSET)
N$34: R703.P$1 U$703.7(ILIM)
N$104: C704.P$1 U$702.6(CSET)
VBAT: R706.P$1 U101.6(BAT:VBAT) U$704.1(POS)
VCAP_1: C715.P$1 U101.49(VCAP_1)
VCAP_2: C717.P$1 U101.73(VCAP_2)
VDD_3V3_SENSORS [power]: C707.P$1 U$702.8(VOUT1) ; also sheet 5
VDD_3V3_SENSORS_EN: R702.P$2 U$702.5(EN1) ; also sheet 1
VDD_3V3_SPEKTRUM [power]: C708.P$1 U$701.8(VOUT1) ; also sheet 2
VDD_3V3_SPEKTRUM_EN: R701.P$2 U$701.5(EN1) ; also sheet 1
VDD_5V [power]: C701.P$1 C702.P$1 R707.P$2 U$701.1(VIN) U$701.4(EN2) U$702.1(VIN) U$703.1(IN) ; also sheet 6,8
VDD_5V_PERIPH [power]: U$703.8(OUT) ; also sheet 2,4
VDD_5V_SENS: R707.P$1 R708.P$1 ; also sheet 1
Unconnected: U$702.7(VOUT2)

### Notes on the sheet
- Bypass caps as close to device pins as possible.
- Note: Maximise copper area connected 
  to center ground pad.
- POR reset 
  delay 1s / uF
- Reset output 1s / uF
  10n = 10ms delay from power good
  to reset de-asserted.
- Current Limits:
  I(limit) = 25000 / R(ilim)
  25K = 1A, 16K5 = 1.5A, 
  47K ~500mA
- FMU Power
  FMU Reset
  Battery backup
  Peripheral power control

## Sheet 8 of 11
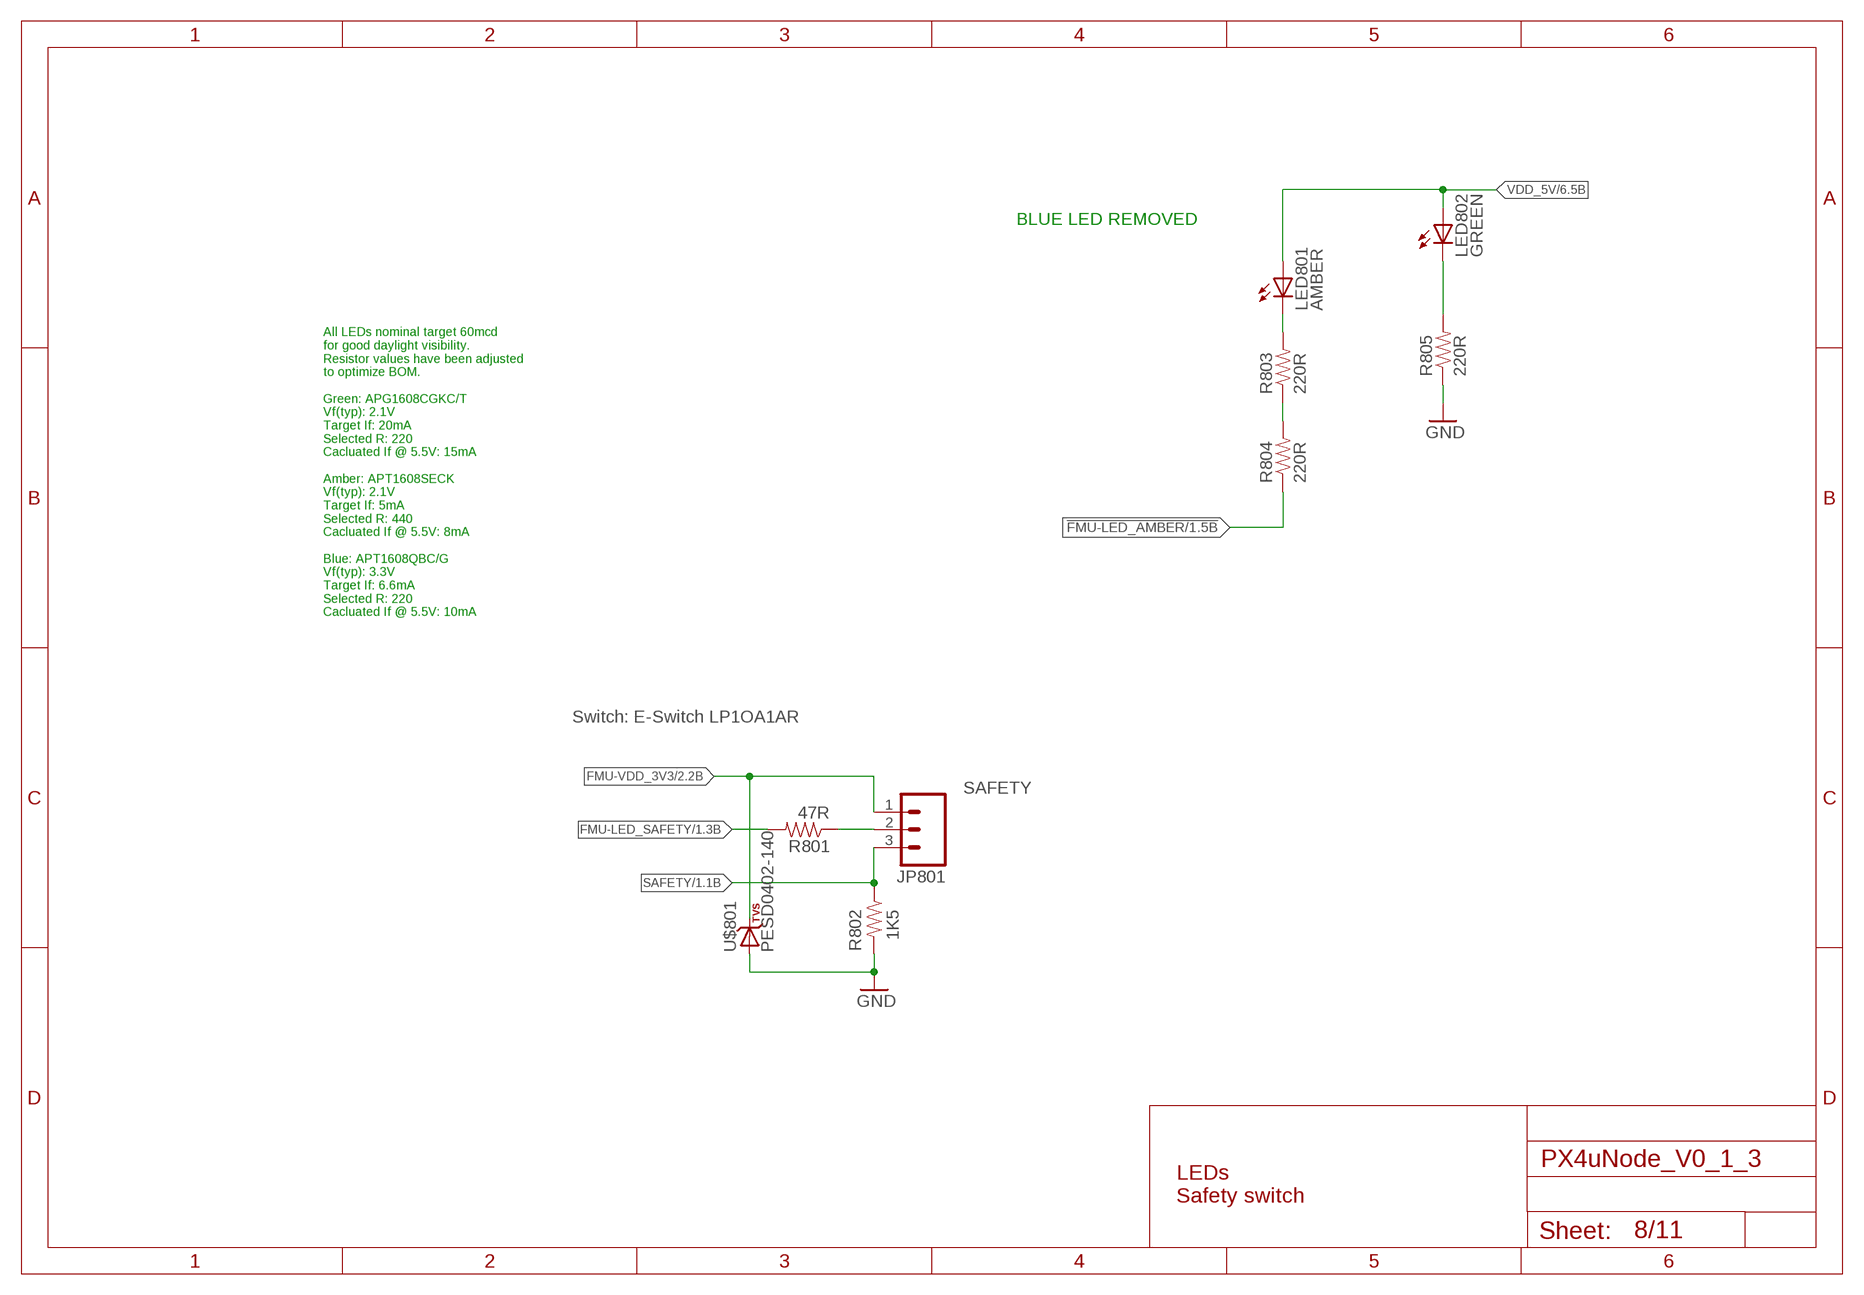
[diagram p7: schematic, sheet 8]

### Parts
JP801  M03PTH  [1X03]
LED801  AMBER  LED0603  [0603-LED]
LED802  GREEN  LED0603  [0603-LED]
R801  47R  RESISTOR0402-RES  [0402-RES]
R802  1K5  RESISTOR0402-RES  [0402-RES]
R803  220R  RESISTOR0402-RES  [0402-RES]
R804  220R  RESISTOR0402-RES  [0402-RES]
R805  220R  RESISTOR0402-RES  [0402-RES]
U$801  PESD0402-140  DIODE-TVS  [0402-TVS]

### Nets
!FMU-LED_AMBER: R804.P$1 ; also sheet 1
FMU-LED_SAFETY: R801.P$2 ; also sheet 1
FMU-VDD_3V3 [power]: JP801.1 U$801.C ; also sheet 2,3,4,7
GND [power]: R802.P$2 R805.P$1 U$801.A ; also sheet 1,2,3,4,5,6,7,9,10
N$7: LED802.C R805.P$2
N$13: R803.P$1 R804.P$2
N$26: LED801.C R803.P$2
N$57: JP801.2 R801.P$1
SAFETY: JP801.3 R802.P$1 ; also sheet 1
VDD_5V [power]: LED801.A LED802.A ; also sheet 6,7

### Notes on the sheet
- BLUE LED REMOVED
- All LEDs nominal target 60mcd
  for good daylight visibility.
  Resistor values have been adjusted
  to optimize BOM.
  
  Green: APG1608CGKC/T
  Vf(typ): 2.1V
  Target If: 20mA
  Selected R: 220
  Cacluated If @ 5.5V: 15mA
  
  Amber: APT1608SECK
  Vf(typ): 2.1V
  Target If: 5mA
  Selected R: 440
  Cacluated If @ 5.5V: 8mA
  
  Blue: APT1608QBC/G
  Vf(typ): 3.3V
  Target If: 6.6mA
  Selected R: 220
  Cacluated If @ 5.5V: 10mA
- Switch: E-Switch LP1OA1AR
- SAFETY
- LEDs
  Safety switch

## Sheet 9 of 11
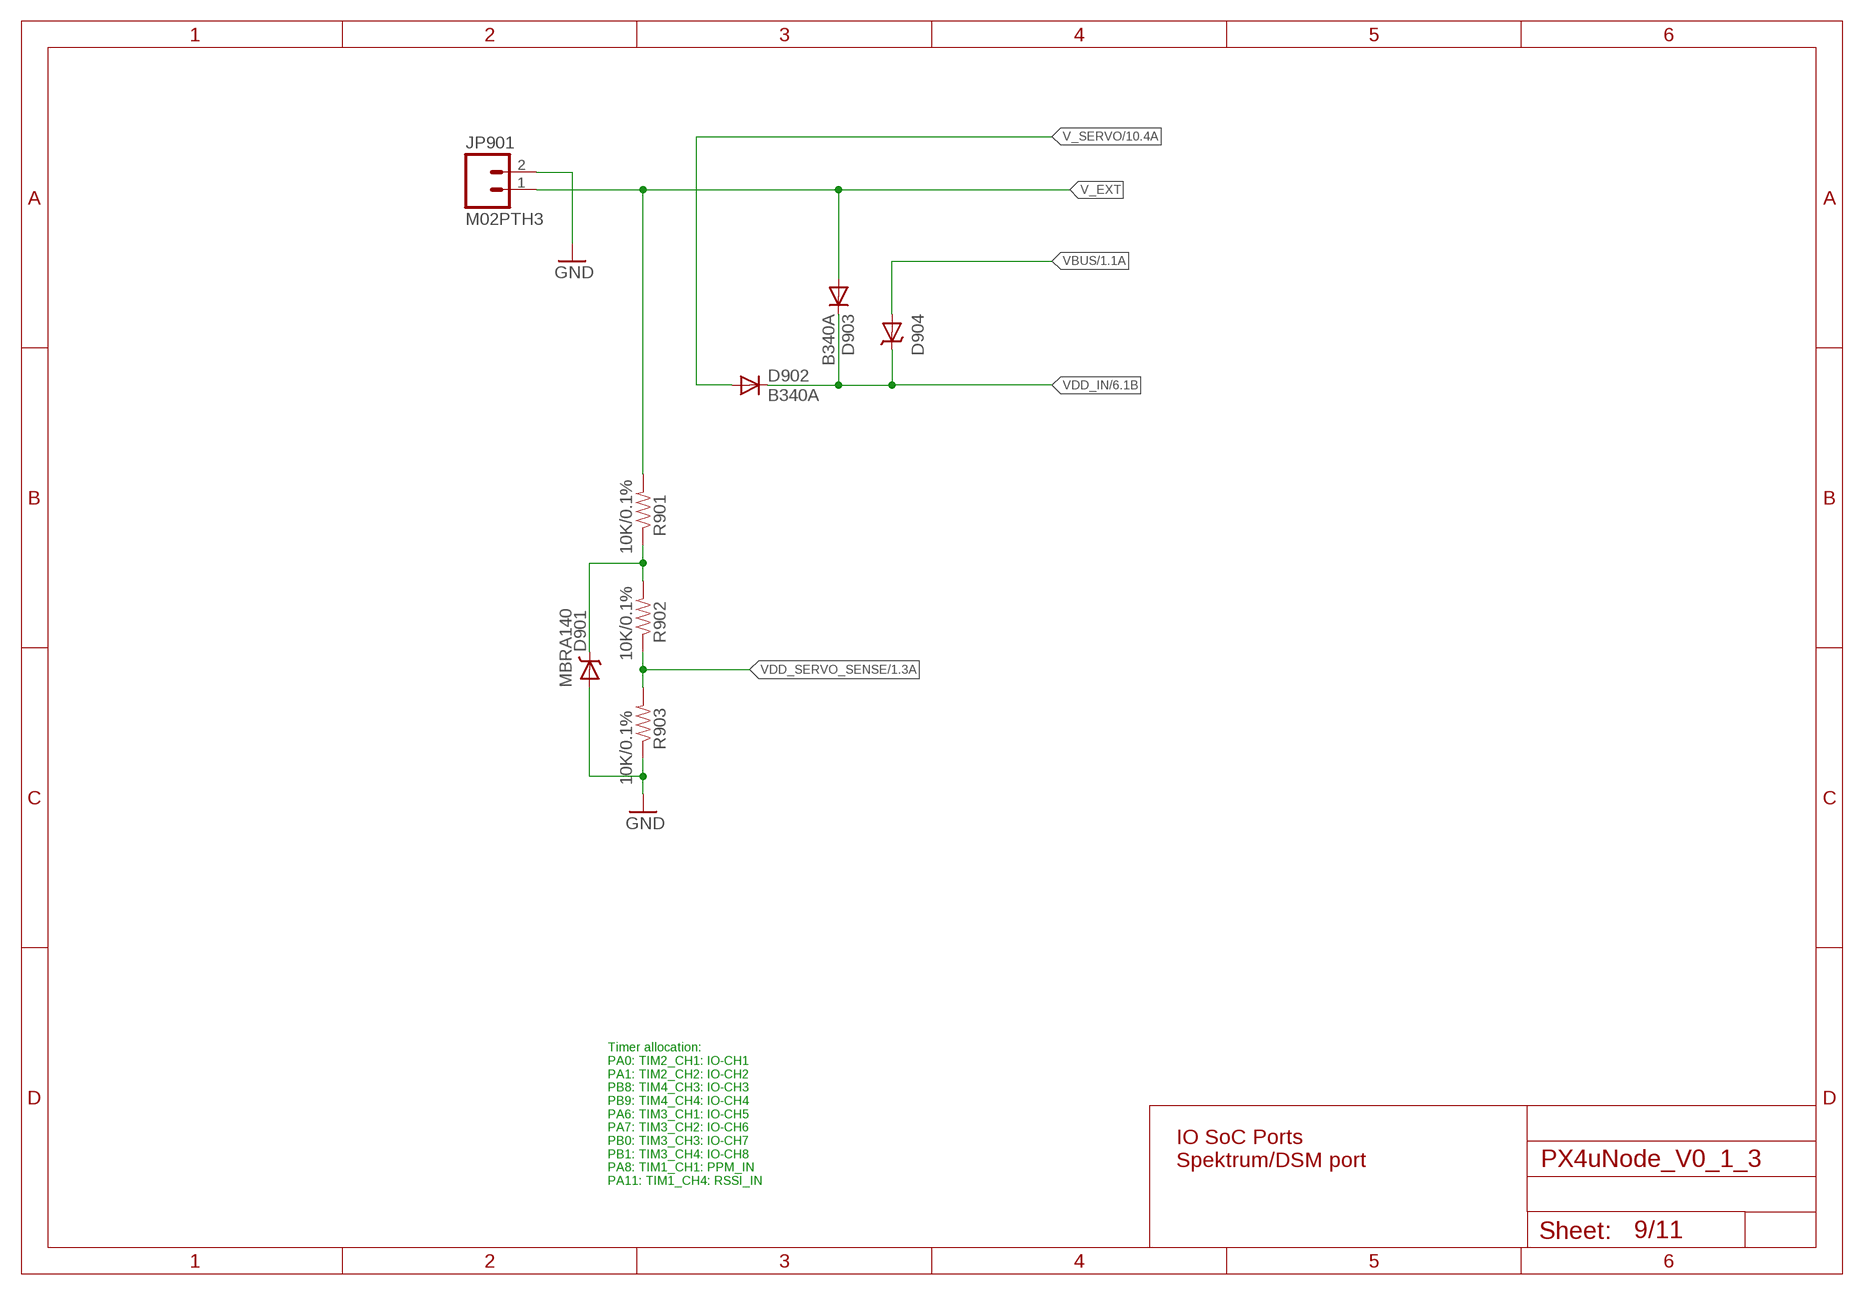
[diagram p8: schematic, sheet 9]

### Parts
D901  DIODE-SCHOTTKY  [SOD-523]
D902  B340A  DIODESMA  [SMA-DIODE]
D903  B340A  DIODESMA  [SMA-DIODE]
D904  MSS1P4-M3  DIODE-SCHOTTKY_MSMP  [MICROSMP]
JP901  M02PTH3  [1X02_LONGPADS]
R901  10K/0.1%  RESISTOR0402-RES  [0402-RES]
R902  10K/0.1%  RESISTOR0402-RES  [0402-RES]
R903  10K/0.1%  RESISTOR0402-RES  [0402-RES]

### Nets
GND [power]: D901.A JP901.2 R903.P$1 ; also sheet 1,2,3,4,5,6,7,8,10
N$6: D901.C R901.P$1 R902.P$2
V_EXT [power]: D903.A JP901.1 R901.P$2
V_SERVO [power]: D902.A ; also sheet 10
VBUS [power]: D904.ANODE(A) ; also sheet 1,3
VDD_IN [power]: D902.C D903.C D904.CATHODE(C) ; also sheet 6
VDD_SERVO_SENSE: R902.P$1 R903.P$2 ; also sheet 1

### Notes on the sheet
- IO SoC Ports
  Spektrum/DSM port
- Timer allocation:
  PA0: TIM2_CH1: IO-CH1
  PA1: TIM2_CH2: IO-CH2
  PB8: TIM4_CH3: IO-CH3
  PB9: TIM4_CH4: IO-CH4
  PA6: TIM3_CH1: IO-CH5
  PA7: TIM3_CH2: IO-CH6
  PB0: TIM3_CH3: IO-CH7
  PB1: TIM3_CH4: IO-CH8
  PA8: TIM1_CH1: PPM_IN
  PA11: TIM1_CH4: RSSI_IN

## Sheet 10 of 11
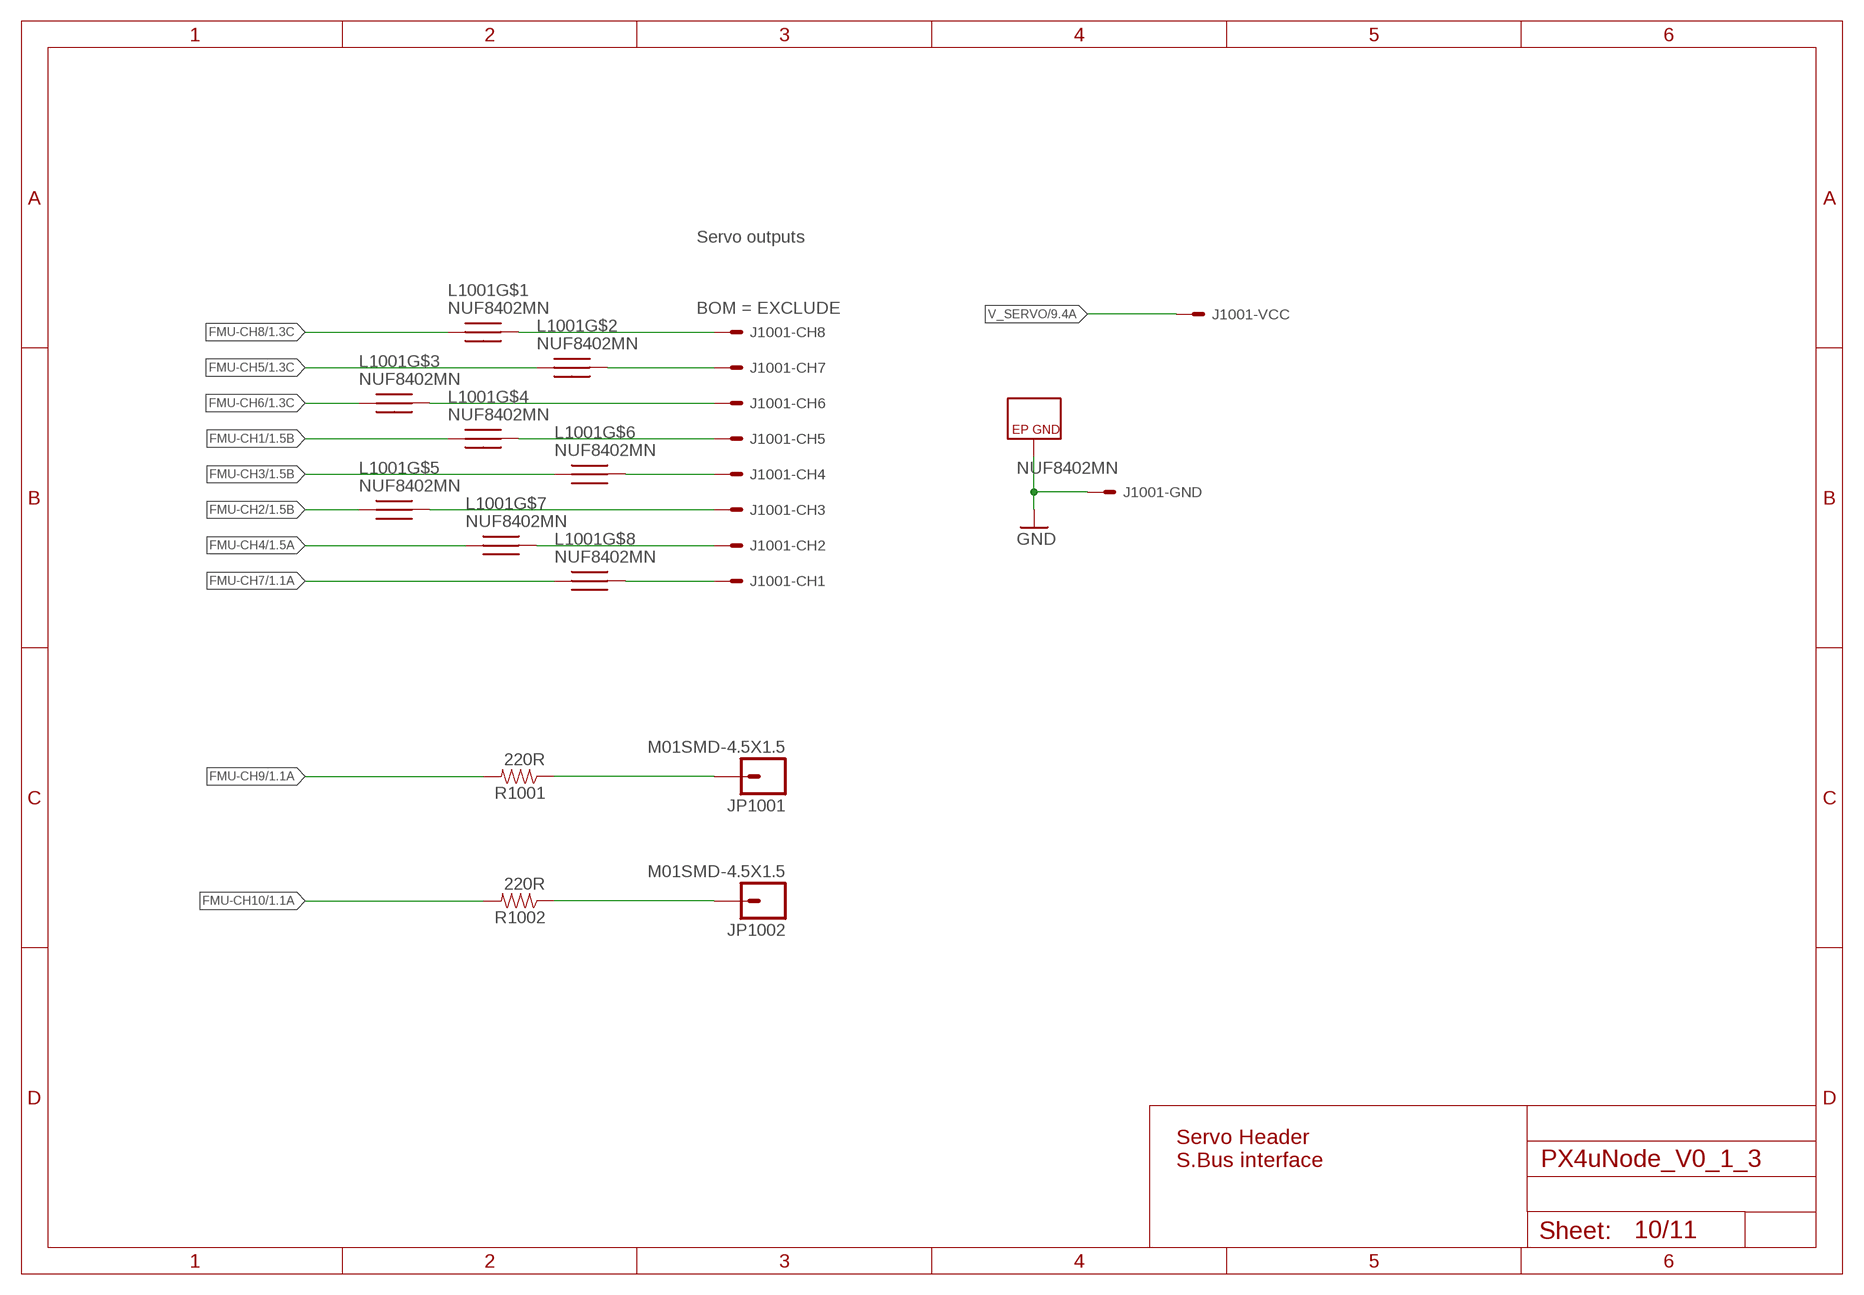
[diagram p9: schematic, sheet 10]

### Parts
J1001  SERVO_HEADER-3X8  [3X8RA_SERVO]
JP1001  M01SMD-4.5X1.5  [PAD-1.5X4.5]
JP1002  M01SMD-4.5X1.5  [PAD-1.5X4.5]
L1001  NUF8402MN  [DFN16-THIN]
R1001  220R  RESISTOR0402-RES  [0402-RES]
R1002  220R  RESISTOR0402-RES  [0402-RES]

### Nets
FMU-CH1: L1001.P$4 ; also sheet 1
FMU-CH1-PROT: J1001.S1 L1001.P$9
FMU-CH2: L1001.P$5 ; also sheet 1
FMU-CH3: L1001.P$6 ; also sheet 1
FMU-CH4: L1001.P$7 ; also sheet 1
FMU-CH5: L1001.P$2 ; also sheet 1
FMU-CH6: L1001.P$3 ; also sheet 1
FMU-CH7: L1001.P$8 ; also sheet 1
FMU-CH8: L1001.P$1 ; also sheet 1,2
FMU-CH9: R1001.P$2 ; also sheet 1
FMU-CH10: R1002.P$2 ; also sheet 1
GND [power]: J1001.GND_S1 J1001.GND_S2 J1001.GND_S3 J1001.GND_S4 J1001.GND_S5 J1001.GND_S6 J1001.GND_S7 J1001.GND_S8 L1001.P$EP(GND) ; also sheet 1,2,3,4,5,6,7,8,9
N$15: J1001.S8 L1001.P$16
N$16: J1001.S7 L1001.P$15
N$19: JP1001.P$1 R1001.P$1
N$23: JP1002.P$1 R1002.P$1
N$36: J1001.S6 L1001.P$14
N$68: J1001.S5 L1001.P$13
N$77: J1001.S4 L1001.P$11
N$78: J1001.S3 L1001.P$12
N$79: J1001.S2 L1001.P$10
V_SERVO [power]: J1001.PWR_S1 J1001.PWR_S2 J1001.PWR_S3 J1001.PWR_S4 J1001.PWR_S5 J1001.PWR_S6 J1001.PWR_S7 J1001.PWR_S8 ; also sheet 9

### Notes on the sheet
- Servo outputs
- Servo Header
  S.Bus interface

## Sheet 11 of 11
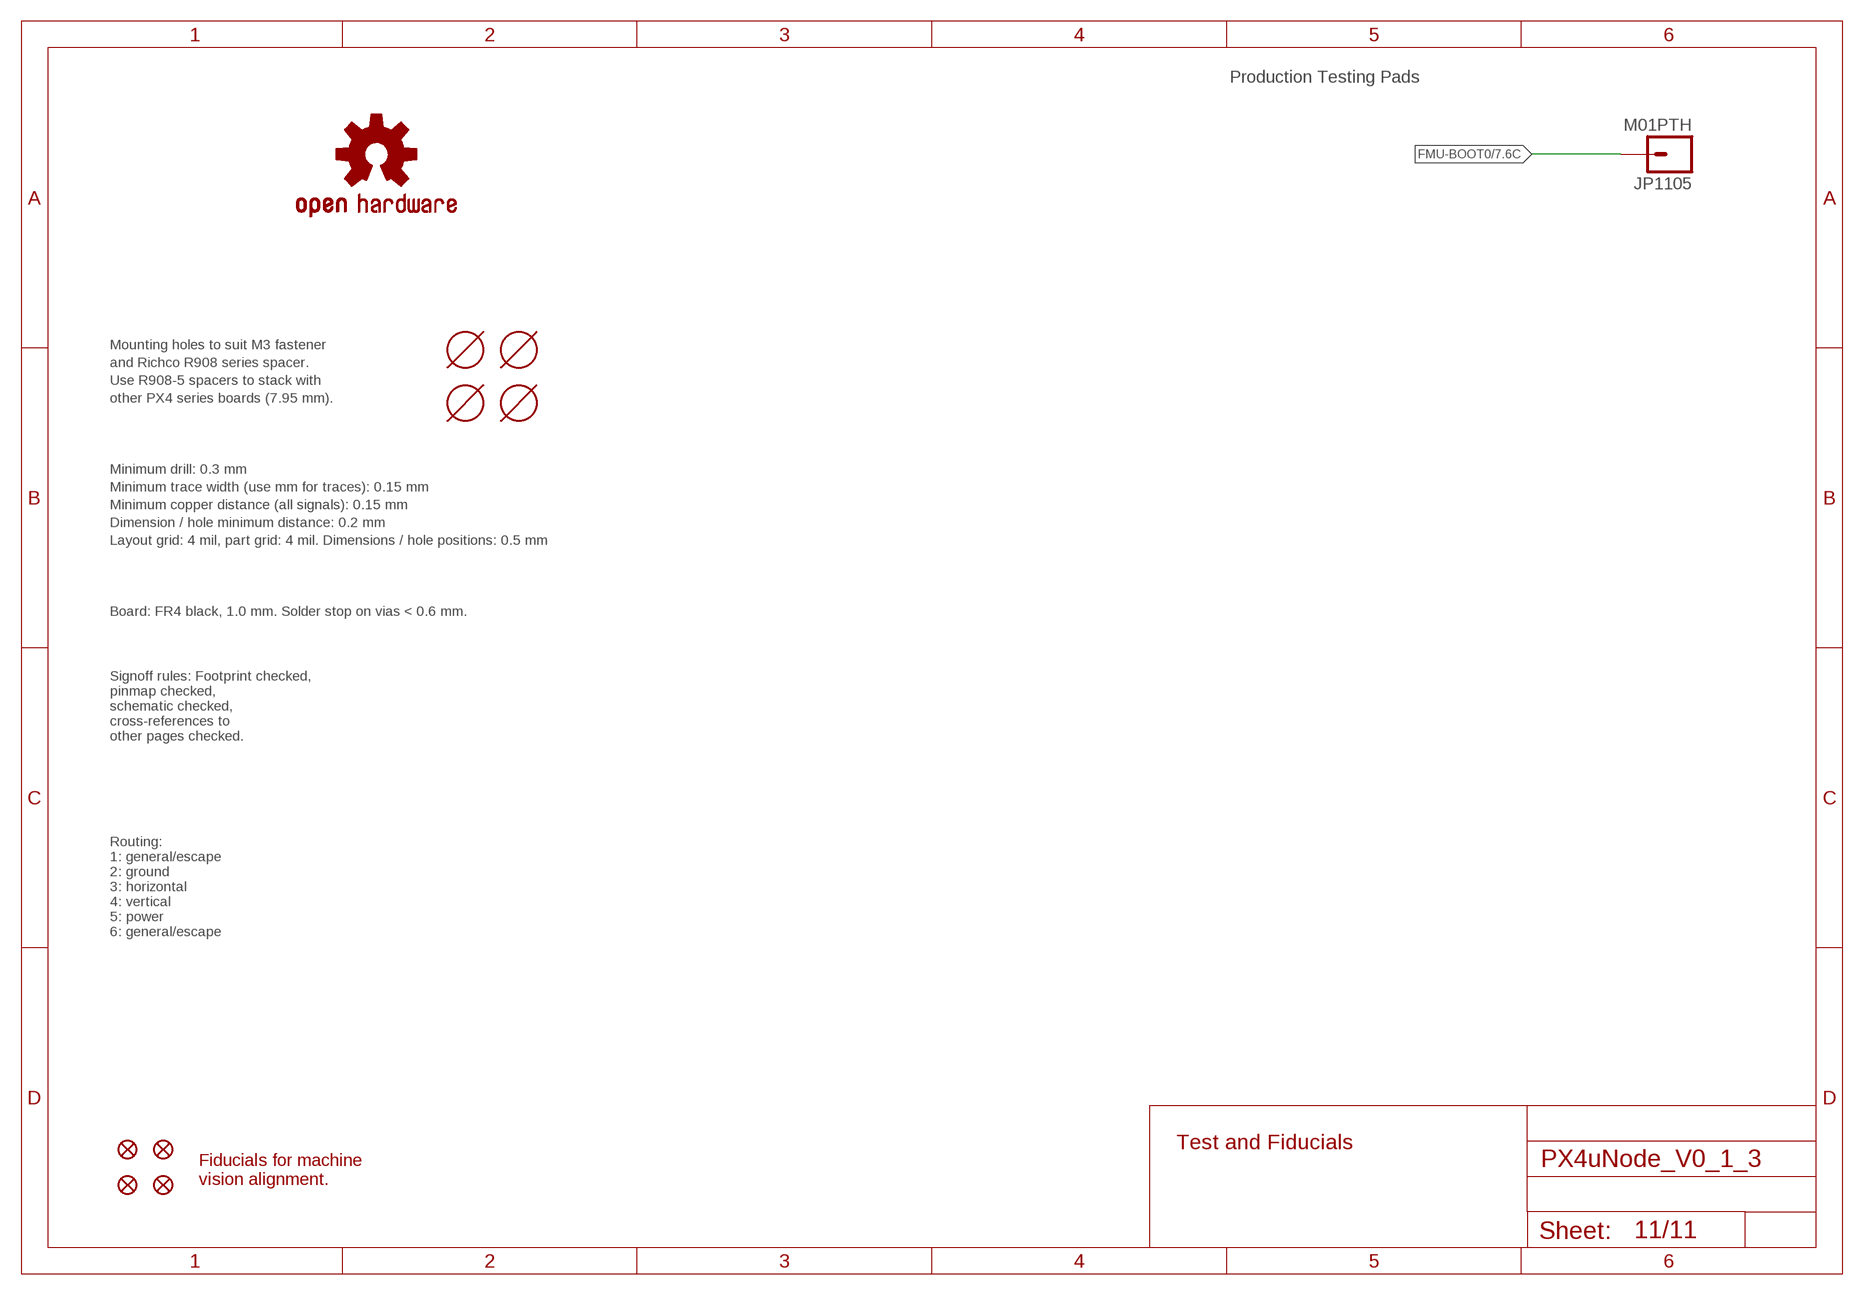
[diagram p10: schematic, sheet 11]

### Parts
JP1101  FIDUCIAL1.5X3  [FIDUCIAL-1.5X3]
JP1102  FIDUCIAL1.5X3  [FIDUCIAL-1.5X3]
JP1103  FIDUCIAL1.5X3  [FIDUCIAL-1.5X3]
JP1104  FIDUCIAL1.5X3  [FIDUCIAL-1.5X3]
JP1105  M01PTH  [1X01]
M3_MOUNT1101  MOUNT-HOLE3.1MM  [MOUNT-HOLE3.1]
M3_MOUNT1102  MOUNT-HOLE3.1MM  [MOUNT-HOLE3.1]
M3_MOUNT1103  MOUNT-HOLE3.1MM  [MOUNT-HOLE3.1]
M3_MOUNT1104  MOUNT-HOLE3.1MM  [MOUNT-HOLE3.1]
OSHW_LOGO  OSHW-LOGOS  [OSHW-LOGO-S]

### Nets
FMU-BOOT0: JP1105.1 ; also sheet 7

### Notes on the sheet
- Production Testing Pads
- Mounting holes to suit M3 fastener
- and Richco R908 series spacer.
- Use R908-5 spacers to stack with
- other PX4 series boards (7.95 mm).
- Minimum drill: 0.3 mm
- Minimum trace width (use mm for traces): 0.15 mm
- Minimum copper distance (all signals): 0.15 mm
- Dimension / hole minimum distance: 0.2 mm
- Layout grid: 4 mil, part grid: 4 mil. Dimensions / hole positions: 0.5 mm
- Board: FR4 black, 1.0 mm. Solder stop on vias < 0.6 mm.
- Signoff rules: Footprint checked,
  pinmap checked,
  schematic checked, 
  cross-references to
  other pages checked.
- Routing:
  1: general/escape
  2: ground
  3: horizontal
  4: vertical
  5: power
  6: general/escape
- Test and Fiducials
- Fiducials for machine
  vision alignment.

## Library data of the parts
C101 C102 = pixhawk2:CAP: Capacitor Standard 0603 ceramic capacitor, and 0.1" leaded capacitor.; PARTNO: C1005C0G1H160
C201 C302 C401-C404 C503 C602 C603 C709-C714 C716 = pixhawk2:CAP: Capacitor Standard 0603 ceramic capacitor, and 0.1" leaded capacitor.; PARTNO: CC0402ZRY5V7BB104
C301 C701 C715 C717 = pixhawk2:CAP: Capacitor Standard 0603 ceramic capacitor, and 0.1" leaded capacitor.; PARTNO: C1608Y5V1C225Z
C501 C706 = pixhawk2:CAP: Capacitor Standard 0603 ceramic capacitor, and 0.1" leaded capacitor.; PARTNO: CC0805ZKY5V6BB106
C502 C703 C704 = pixhawk2:CAP: Capacitor Standard 0603 ceramic capacitor, and 0.1" leaded capacitor.; PARTNO: CC0402KRX7R7BB103
C601 C604-C606 = SparkFun-Capacitors:22UF-16V-20%-(1210): CAP-10381; PARTNO: C3225X7R1C226M250AC; PROD_ID: CAP-10381
C702 C705 C707 C708 = pixhawk2:CAP: Capacitor Standard 0603 ceramic capacitor, and 0.1" leaded capacitor.; PARTNO: CC0603ZRY5V7BB105
D701 D901 = SparkFun-DiscreteSemi:DIODE-SCHOTTKY: Commonly MBRA140.; PARTNO: MBRA140
D902 D903 = SparkFun-DiscreteSemi:DIODE: Diode These are standard reverse protection diodes and small signal diodes. SMA package can handle up to about 1A. SOD-323 can handle about 200mA. What the SOD-323 package when ordering, there are some mfgs out there that are 5-pin packages.; PARTNO: B340A
D904 = pixhawk2:DIODE-SCHOTTKY: Schottky barrier diode in DO214AC, e.g. Fairchild SS14.; PARTNO: MSS1P4-M3/89A
J401 = SparkFun-Connectors:M04X2: .1" header, two rows of four.; BOM: EXCLUDE
J1001 = PX4lite:SERVO_HEADER-3X8: 3x10 servo header; BOM: EXCLUDE
JP201 = SparkFun-Passives:JUMPER-3; BOM: EXCLUDE
JP202 = PX4lite:HEADER-3X1: Single row 0.1" servo header; BOM: EXCLUDE
JP203-JP205 = SparkFun-Connectors:M03X2: 2x3 .1" header. Shrouded, with keying- CONN-10681 SMT- CONN-11415 Pogo pins- HW-11044; BOM: EXCLUDE
JP301 JP401 JP402 JP404 JP405 = SparkFun-Connectors:M04: Header 4 Standard 4-pin 0.1" header. Use with straight break away headers (SKU : PRT-00116), right angle break away headers (PRT-00553), swiss pins (PRT-00743), machine pins (PRT-00117), and female headers (PRT-00115). Molex polarized connector foot print use with SKU : PRT-08231 with associated crimp pins and housings. 1MM SMD Version SKU: PRT-10208; BOM: EXCLUDE
JP403 = SparkFun-Connectors:M03: Header 3 Standard 3-pin 0.1" header. Use with straight break away headers (SKU : PRT-00116), right angle break away headers (PRT-00553), swiss pins (PRT-00743), machine pins (PRT-00117), and female headers (PRT-00115). Molex polarized connector foot print use with SKU : PRT-08232 with associated crimp pins and housings.; PARTNO: EXCLUDE
JP801 = SparkFun-Connectors:M03: Header 3 Standard 3-pin 0.1" header. Use with straight break away headers (SKU : PRT-00116), right angle break away headers (PRT-00553), swiss pins (PRT-00743), machine pins (PRT-00117), and female headers (PRT-00115). Molex polarized connector foot print use with SKU : PRT-08232 with associated crimp pins and housings.; BOM: EXCLUDE
JP901 = SparkFun-Connectors:M02: Standard 2-pin 0.1" header. Use with - straight break away headers ( PRT-00116) - right angle break away headers (PRT-00553) - swiss pins (PRT-00743) - machine pins (PRT-00117) - female headers (PRT-00115) Molex polarized connector foot print use with: PRT-08233 with associated crimp pins and housings. 2.54_SCREWTERM for use with PRT-10571. 3.5mm Screw Terminal footprints for PRT-08084 5mm Screw Terminal footprints for use with PRT-08433; BOM: EXCLUDE
JP1001 JP1002 = SparkFun-Connectors:M01: Header 1 Standard 1-pin 0.1" header. Use with straight break away headers (SKU : PRT-00116), right angle break away headers (PRT-00553), swiss pins (PRT-00743), machine pins (PRT-00117), and female headers (PRT-00115).; BOM: EXCLUDE
JP1101-JP1104 = pixhawk2:FIDUCIAL: Fiducial Alignment Points Various fiducial points for machine vision alignment.; BOM: EXCLUDE; PARTNO: *
JP1105 = SparkFun-Connectors:M01: Header 1 Standard 1-pin 0.1" header. Use with straight break away headers (SKU : PRT-00116), right angle break away headers (PRT-00553), swiss pins (PRT-00743), machine pins (PRT-00117), and female headers (PRT-00115).
JX301 = pixhawk2:ARM_MINI_JTAG: CONNECTOR wire to board 1.25 mm (.049 inch) pitch header; BOM: EXCLUDE; PARTNO: M50-3900542
L201 L202 L403 L1001 = PX4lite:NUF8402MN: NUF8402 OnSemi ESD and EMI filter; PARTNO: NUF8402MN
L203 L401 L402 L404 = PX4lite:KNH16C104DA5TS: Kyocera KNH16C104DA5TS EMI filter; PARTNO: KNH16C104DA5TS
L$601 = matts_lib:IND_4X4_MULTI: Multi device pads for Coilcraft and Wurth inductors; DCR: 0.02; IDC: 3.7; L: 2.2E-6; MANUFACTURER_NAME: Coilcraft; MANUFACTURER_PART_NUMBER: XFL4020-222MEB; PARTNO: XFL4020-222MEB; VENDOR: Coilcraft
LED801 = pixhawk2:LED: LEDs Standard schematic elements and footprints for 5mm, 3mm, 1206, and 0603 sized LEDs. 5mm - Spark Fun Electronics SKU : COM-00529 (and others); PARTNO: APTD1608SECK
LED802 = pixhawk2:LED: LEDs Standard schematic elements and footprints for 5mm, 3mm, 1206, and 0603 sized LEDs. 5mm - Spark Fun Electronics SKU : COM-00529 (and others); PARTNO: APTD1608CGCK
M3_MOUNT1101-M3_MOUNT1104 = pixhawk2:MOUNT-HOLE; BOM: EXCLUDE; PARTNO: *
OSHW_LOGO = pixhawk2:OSHW-LOGO: Open Source Hardware Logo This logo indicates the piece of hardware it is found on incorporates a OSHW license and/or adheres to the definition of open source hardware found here: http://freedomdefined.org/OSHW; BOM: EXCLUDE; PARTNO: *
R101 R203 R204 R701 R702 R704 R705 R709 = pixhawk2:RESISTOR: Resistor Basic schematic elements and footprints for 0603, 1206, and PTH 1/10th watt (small) resistors.; PARTNO: RC0402FR-0710KL
R201 R202 R407 R408 = pixhawk2:RESISTOR: Resistor Basic schematic elements and footprints for 0603, 1206, and PTH 1/10th watt (small) resistors.; PARTNO: RC0402FR-07120RL
R401-R404 R802 = pixhawk2:RESISTOR: Resistor Basic schematic elements and footprints for 0603, 1206, and PTH 1/10th watt (small) resistors.; PARTNO: RC0402FR-071K5L
R405 R406 R707 R708 R901-R903 = pixhawk2:RESISTOR: Resistor Basic schematic elements and footprints for 0603, 1206, and PTH 1/10th watt (small) resistors.; PARTNO: ERA-2AEB103X
R703 = pixhawk2:RESISTOR: Resistor Basic schematic elements and footprints for 0603, 1206, and PTH 1/10th watt (small) resistors.; PARTNO: RMCF0402FT47K
R706 = pixhawk2:RESISTOR: Resistor Basic schematic elements and footprints for 0603, 1206, and PTH 1/10th watt (small) resistors.; PARTNO: RC0402FR-071KL
R801 = pixhawk2:RESISTOR: Resistor Basic schematic elements and footprints for 0603, 1206, and PTH 1/10th watt (small) resistors.; PARTNO: RC0402JR-0747RL
R803-R805 R1001 R1002 = pixhawk2:RESISTOR: Resistor Basic schematic elements and footprints for 0603, 1206, and PTH 1/10th watt (small) resistors.; PARTNO: RC0402FR-07220RL
S701 = pixhawk2:SWITCH-MOMENTARY-2; PARTNO: EVQP7J01K
SJ401 SJ402 = SparkFun-Passives:SOLDERJUMPER: Solder Jumper Standard SMD solder jumper. Used to automate production. Two varients : Normally Open and Normally Closed are the same, but have different paste layers. NC will have a large amount of paste and should jumper during reflow.; BOM: EXCLUDE
TP1-TP5 = testpad:TP: Test pad
U101 = pixhawk2:STM32F4X7VX: STM32F4X7VX 100 pin LQFP STM32F407VE - 512 KB flash, no crypto STM32F407VG - 1 MB flash, no crypto STM32F417VE - 512 KB flash, with crypto STM32F417VG - 1 MB flash, with crypto; PARTNO: STM32F427VI
U401 U402 = pixhawk2:MAX3051: 3.3-V CAN TRANSCEIVER; PARTNO: MAX3051EKA
U$201 U$202 U$204 U$401 U$402 U$801 = pixhawk2:DIODE-TVS; PARTNO: PESD0402-140
U$203 = PX4lite:74LVC2G240: Dual inverter tri-state, 3.3V/5V compatible http://www.nxp.com/documents/data_sheet/74LVC2G240.pdf http://focus.ti.com/lit/ds/symlink/sn74lvc2g240.pdf; PARTNO: 74LVC2G240
U$301 = PX4lite:NUF2042XV6; PARTNO: NUF2042XV6
U$302 = PX4lite:W25Q64FV: W25Q64FV Winbond 64Mbit Flash; PARTNO: W25Q64FVZP
U$501 = PX4lite:MAX21100; PARTNO: MAX21100+
U$601 = PX4lite:TPS6303X: TPS6303x buck-boost; PARTNO: TPS63061DSCT
U$701 U$702 = pixhawk2:MIC5332; PARTNO: MIC5332-SSYMT
U$703 = PX4lite:BQ24315; PARTNO: BQ24315DSGR
U$704 = pixhawk2:MS621FE: SEIKO 6.8mm Rechargeable 3V lithium battery If discontinued or not available, similar devices are available from Panasonic and Sanyo, usually direct replacements.; BOM: EXCLUDE; DATASHEET: http://speed.sii.co.jp/data/file_PRODUCT_MASTER_50112_TITLE_IMAGESP.pdf; LINK: http://search.digikey.com/us/en/products/MS621FE-FL11E/728-1057-ND/1889208; MFGPN: MS621FE
X101 = pixhawk2:OSCILLATOR: Crystal Oscillator in 3.2x2.5 SMD; PARTNO: ABM8G-24.000MHZ-4Y-T3

## Net classes
0 signal: width 0.152 mm, drill 0.2 mm, clearance 0.152 mm
1 power: width 0.254 mm, drill 0.3 mm, clearance 0.152 mm